# Altium project Capstone_Mainboard_B.PrjPcb (part 1 of 3)
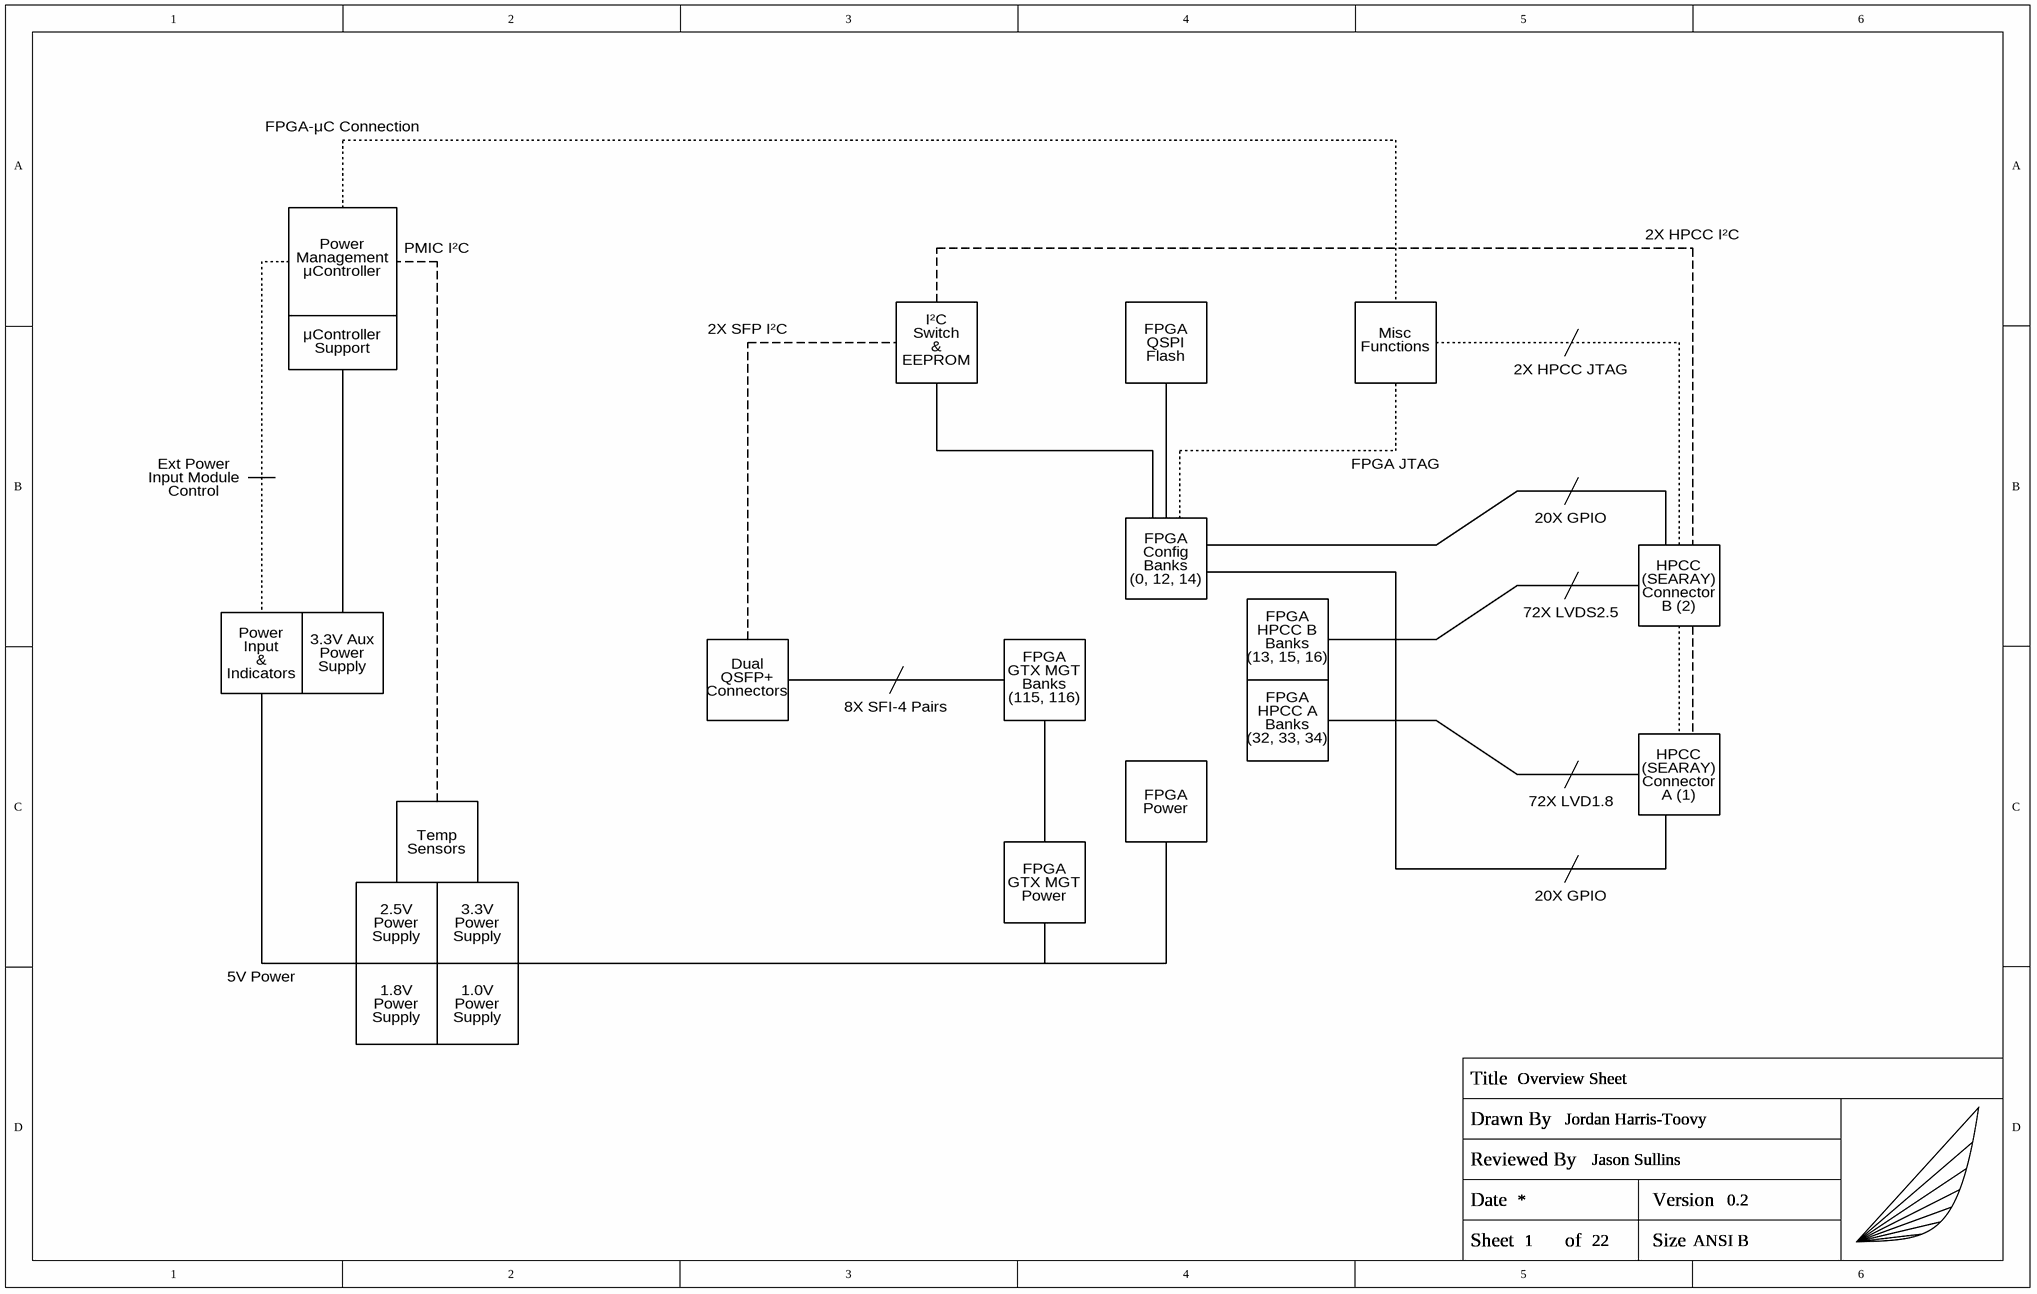
[diagram p0: Overview_Sheet.SchDoc]
22 sheets, 369 parts. Net scope: global (net labels, ports and power ports of the same name join across sheets).
Board file: Main_Board.PcbDoc
Sheets:
  Overview_Sheet.SchDoc
    FPGA QSPI FLASH = Flash_FPGA.SchDoc
    I2C Switch & EEPROM = I2C_Switch_EEPROM.SchDoc
    QSFP+ Connectors = QSFP_Connectors.SchDoc
    HPCC Connector A = HPCC_Connector_A.SchDoc
    HPCC Connector B = HPCC_Connector_B.SchDoc
    3.3V Power Supply = PMIC_3V3.SchDoc
    2.5V Power Supply = PMIC_2V5.SchDoc
    1.8V Power Supply = PMIC_1V8.SchDoc
    1.0V Power Supply = PMIC_1V0.SchDoc
    PMIC-Area Temperature Sensors = I2C_Temperature_Sensors.SchDoc
    Management Microcontroller = Management_RP2040.SchDoc
    FPGA Power Banks = FPGA_Power.SchDoc
    FPGA Configuration Banks = FGPA_Configuration.SchDoc
    FPGA HPCC A Banks = FPGA_HPCC_A_DPs.SchDoc
    FPGA HPCC B Banks = FPGA_HPCC_B_DPs.SchDoc
    FPGA GTX Banks = FPGA_GTXs.SchDoc
    Power Inputs and LEDs = Power_Input_Indicators.SchDoc
    Miscellaneous Functions = Miscellaneous_Functions.SchDoc
    GTX Power Supplies = PMIC_GTXs.SchDoc
    Management Microcontroller Support = Management_RP2040_Support.SchDoc
    3.3V Auxiliary Power Supply = PMIC_3V3AUX_PWR-DEF.SchDoc

## Sheet Overview_Sheet.SchDoc: Overview Sheet
size B; CheckedBy: Jason Sullins; Author: Jordan Harris-Toovy; Revision: 0.2; SheetNumber: 1; SheetTotal: 22; Size: ANSI B

### Parts
(Parts that share a designator on the sheet are numbered #1, #2 ... from top to bottom, then left to right.)
TITLEBLOCK?#1  Capstone_Title_Block  (value not drawn)  (graphical)

### Sub-sheets
1.0V Power Supply = PMIC_1V0.SchDoc: no entries
1.8V Power Supply = PMIC_1V8.SchDoc: no entries
2.5V Power Supply = PMIC_2V5.SchDoc: no entries
3.3V Auxiliary Power Supply = PMIC_3V3AUX_PWR-DEF.SchDoc: no entries
3.3V Power Supply = PMIC_3V3.SchDoc: no entries
FPGA Configuration Banks = FGPA_Configuration.SchDoc: no entries
FPGA GTX Banks = FPGA_GTXs.SchDoc: no entries
FPGA HPCC A Banks = FPGA_HPCC_A_DPs.SchDoc: no entries
FPGA HPCC B Banks = FPGA_HPCC_B_DPs.SchDoc: no entries
FPGA Power Banks = FPGA_Power.SchDoc: no entries
FPGA QSPI FLASH = Flash_FPGA.SchDoc: no entries
GTX Power Supplies = PMIC_GTXs.SchDoc: no entries
HPCC Connector A = HPCC_Connector_A.SchDoc: no entries
HPCC Connector B = HPCC_Connector_B.SchDoc: no entries
I2C Switch & EEPROM = I2C_Switch_EEPROM.SchDoc: no entries
Management Microcontroller = Management_RP2040.SchDoc: no entries
Management Microcontroller Support = Management_RP2040_Support.SchDoc: no entries
Miscellaneous Functions = Miscellaneous_Functions.SchDoc: no entries
PMIC-Area Temperature Sensors = I2C_Temperature_Sensors.SchDoc: no entries
Power Inputs and LEDs = Power_Input_Indicators.SchDoc: no entries
QSFP+ Connectors = QSFP_Connectors.SchDoc: no entries

### Notes on the sheet
- FPGA-μC Connection
- 2X HPCC I²C
- Power
- Management
- μController
- PMIC I²C
- Support
- 2X SFP I²C
- I²C
- Switch
- &
- EEPROM
- FPGA
- QSPI
- Flash
- Misc
- Functions
- 2X HPCC JTAG
- Ext Power
- Input Module
- Control
- FPGA JTAG
- Config
- Banks
- 20X GPIO
- HPCC
- Input
- 3.3V Aux
- (0, 12, 14)
- HPCC B
- 72X LVDS2.5
- (SEARAY)
- Connector
- B (2)
- Indicators
- Supply
- Dual
- QSFP+
- Connectors
- 8X SFI-4 Pairs
- GTX MGT
- (115, 116)
- (13, 15, 16)
- HPCC A
- (32, 33, 34)
- Temp
- 72X LVD1.8
- A (1)
- 2.5V
- Sensors
- 3.3V
- 5V Power
- 1.8V
- 1.0V
- (in symbol Capstone_Title_Block) Title; Drawn By; Reviewed By; Date; Version; Sheet; of; Size

### Library data of the parts
TITLEBLOCK?#1 = Capstone_Title_Block: Custom title block with personal logo; Manufacturer: NONE; Manufacturer Part Number: NONE

## Sheet Flash_FPGA.SchDoc: FPGA QSPI FLASH
size B; CheckedBy: Jason Sullins; Author: Jordan Harris-Toovy; Revision: 0.2; SheetNumber: 21; SheetTotal: 22; Size: ANSI B
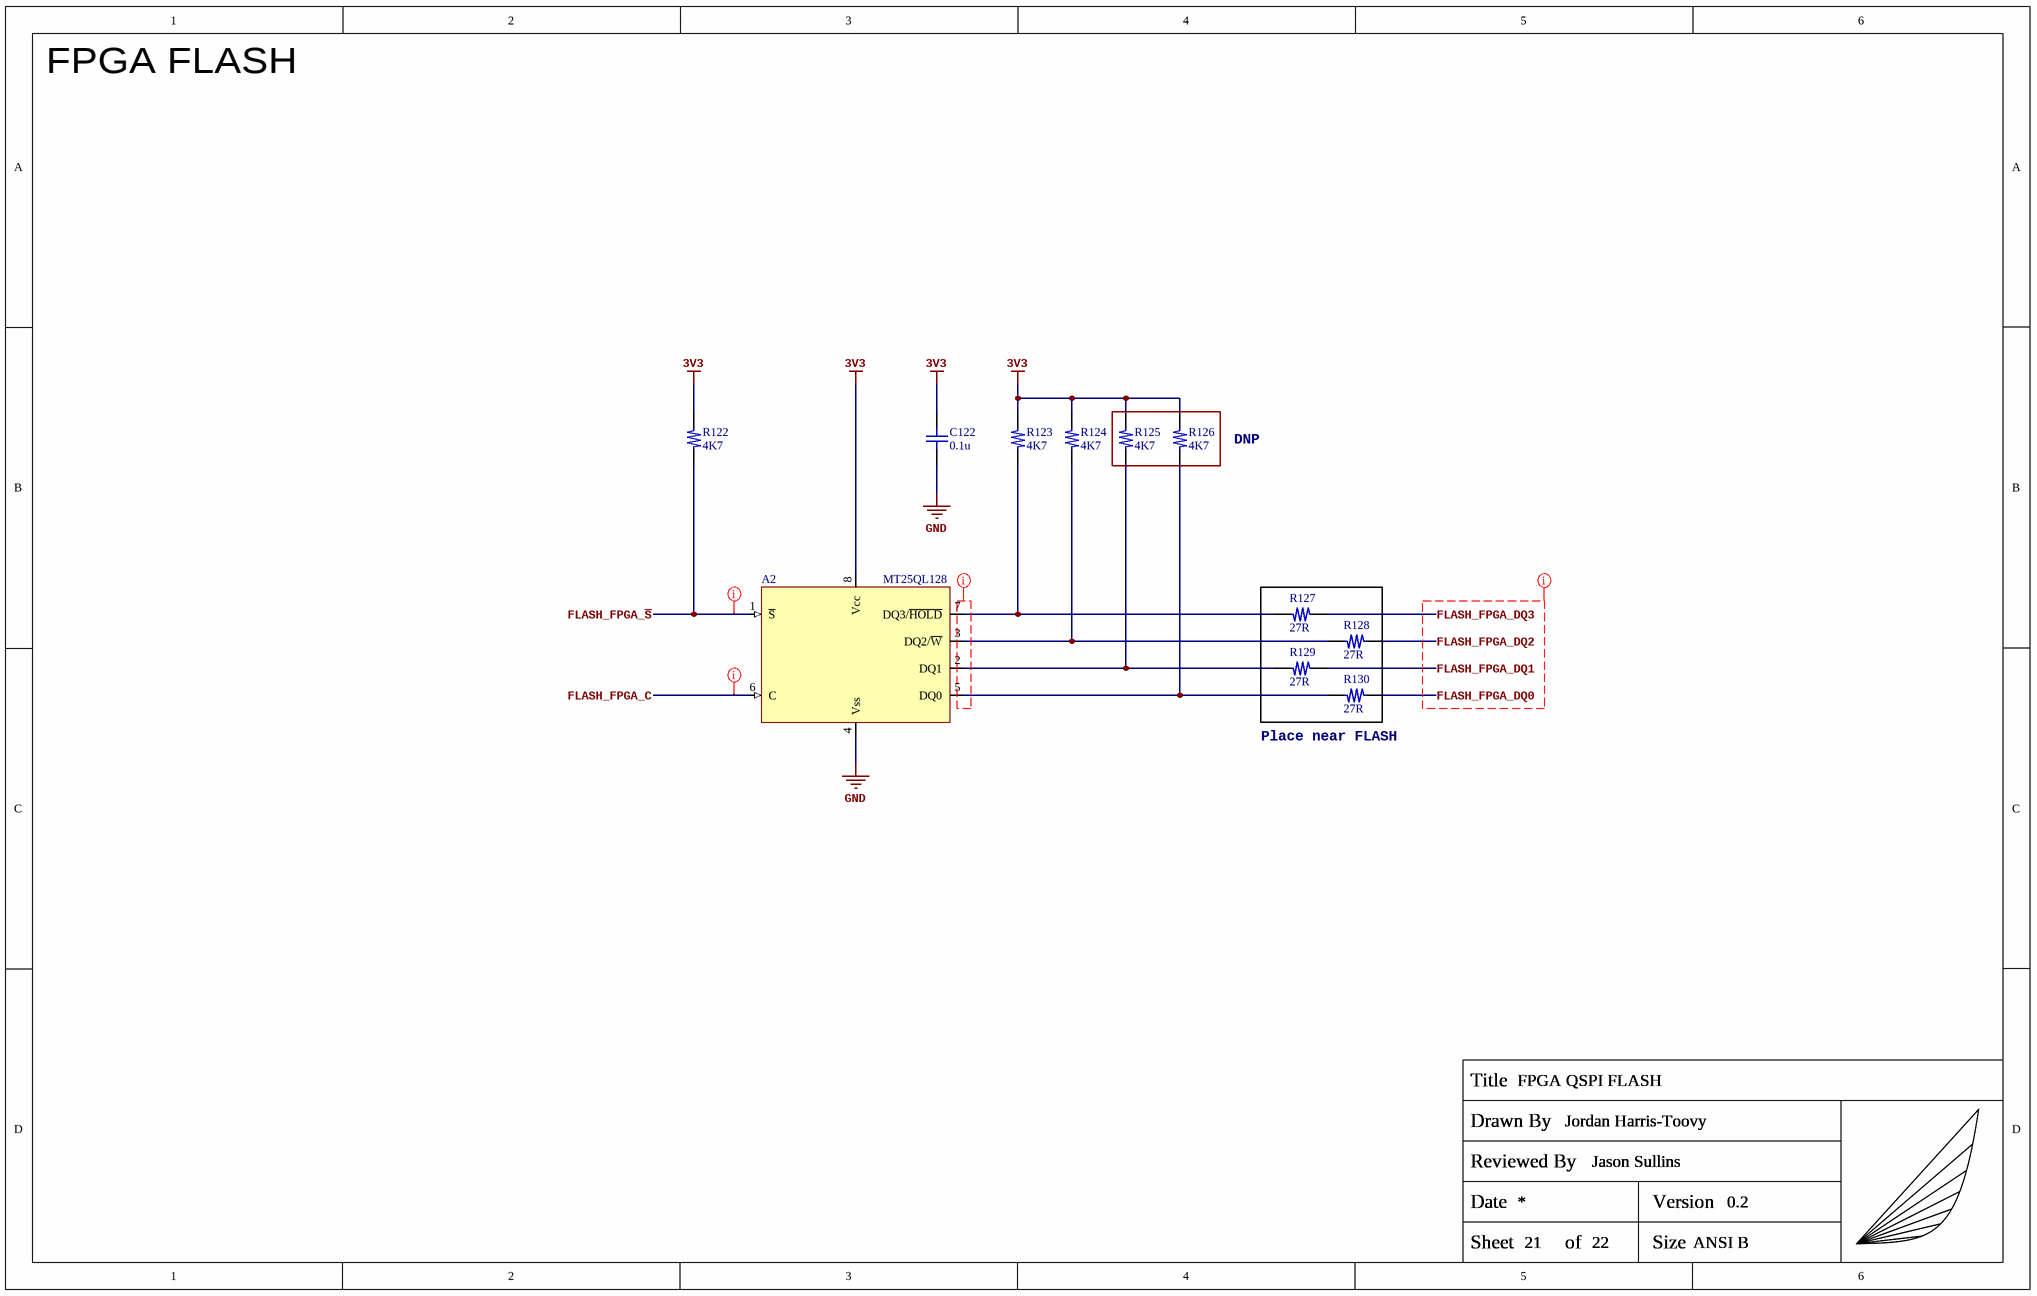
[diagram p1: Flash_FPGA.SchDoc]

### Parts
(Parts that share a designator on the sheet are numbered #1, #2 ... from top to bottom, then left to right.)
A2  MT25QL128  [LOTES_ACA-SPI-004-K01]
C122  0.1u  [C_0402_Generic]
R122  4K7  [R_0402_Generic]
R123  4K7  [R_0402_Generic]
R124  4K7  [R_0402_Generic]
R125  4K7  [R_0402_Generic]
R126  4K7  [R_0402_Generic]
R127  27R  [R_0402_Generic]
R128  27R  [R_0402_Generic]
R129  27R  [R_0402_Generic]
R130  27R  [R_0402_Generic]
TITLEBLOCK?#2  Capstone_Title_Block  (value not drawn)  (graphical)

### Nets
3V3: A2.8(Vcc) C122.2 R122.2 R123.2 R124.2 R125.2 R126.2
GND: A2.4(Vss) C122.1
FLASH_FPGA_C: A2.6(C)
FLASH_FPGA_DQ0: R130.1
FLASH_FPGA_DQ1: R129.1
FLASH_FPGA_DQ2: R128.1
FLASH_FPGA_DQ3: R127.1
FLASH_FPGA_~{S}: A2.1(~{S}) R122.1
NetA2_2: A2.2(DQ1) R125.1 R129.2
NetA2_3: A2.3(DQ2/~{W}) R124.1 R128.2
NetA2_5: A2.5(DQ0) R126.1 R130.2
NetA2_7: A2.7(DQ3/~{HOLD}) R123.1 R127.2

### Layout directives
net class SE50_FGPA_FLASH: FLASH_FPGA_C, FLASH_FPGA_DQ0, FLASH_FPGA_DQ1, FLASH_FPGA_DQ2, FLASH_FPGA_DQ3, FLASH_FPGA_~{S}
net class SE50_GENERAL: (no net found under the mark)

### Notes on the sheet
- FPGA FLASH
- DNP
- (near R130) Place near FLASH
- (in symbol Capstone_Title_Block) Title; Drawn By; Reviewed By; Date; Version; Sheet; of; Size

### Library data of the parts
A2 = MT25QL128ABA1ESE_ACA-SPI-004: FLASH - NOR Memory IC 128Mbit SPI (Q)SPI 133 MHz 8-SO In ACA-SPI-004-K01 socket; Manufacturer: Micron Technology Inc; Manufacturer Part Number: MT25QL128ABA1ESE; Manufacturer2: LOTES; Manufacturer2 Part Number: ACA-SPI-004-K01
C122 = GRM155R71C104KA88D: 0.1µF 16V X7R SMD ceramic capacitor in 0402 size; Manufacturer: Murata Electronics; Manufacturer Part Number: GRM155R71C104KA88D
R122-R126 = ERJ-2RKF4701X: 4.7KOhm 1% 1/10W SMD resistor in 0402 size; Manufacturer: Panasonic; Manufacturer Part Number: ERJ-2RKF4701X
R127-R130 = ERJ-2RKF27R0X: 27Ohm 1% 1/10W SMD resistor in 0402 size; Manufacturer: Panasonic; Manufacturer Part Number: ERJ-2RKF27R0X
TITLEBLOCK?#2 = Capstone_Title_Block: as TITLEBLOCK?#1 on sheet Overview_Sheet; Manufacturer Part Number: NONE

## Sheet I2C_Switch_EEPROM.SchDoc: I²C Switch & EEPROM
size B; CheckedBy: Jason Sullins; Author: Jordan Harris-Toovy; Revision: 0.2; SheetNumber: 5; SheetTotal: 22; Size: ANSI B
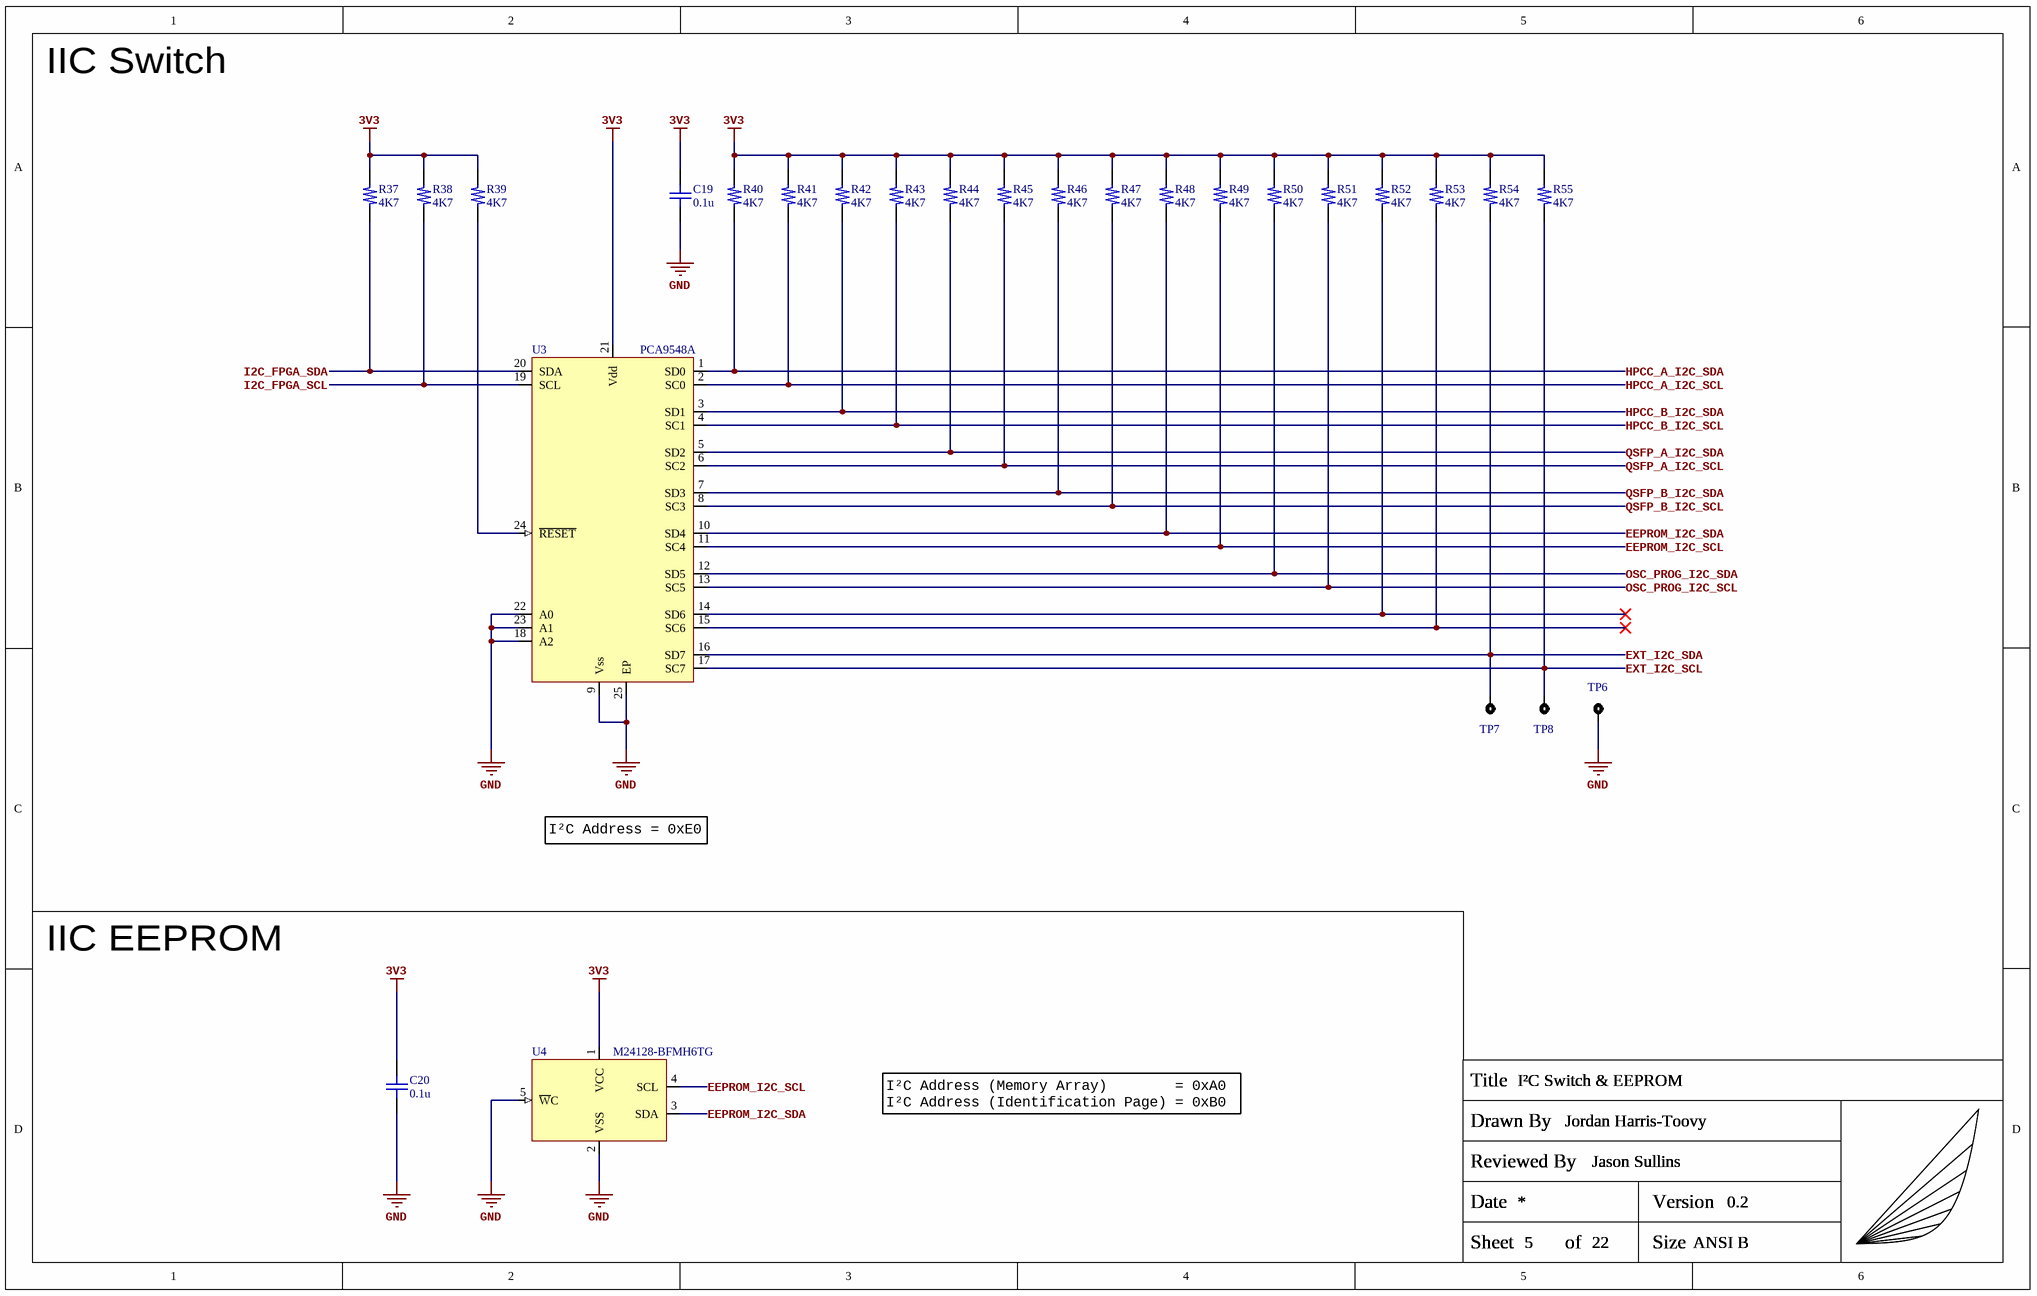
[diagram p2: I2C_Switch_EEPROM.SchDoc]

### Parts
(Parts that share a designator on the sheet are numbered #1, #2 ... from top to bottom, then left to right.)
C19  0.1u  [C_0402_Generic]
C20  0.1u  [C_0402_Generic]
R37  4K7  [R_0402_Generic]
R38  4K7  [R_0402_Generic]
R39  4K7  [R_0402_Generic]
R40  4K7  [R_0402_Generic]
R41  4K7  [R_0402_Generic]
R42  4K7  [R_0402_Generic]
R43  4K7  [R_0402_Generic]
R44  4K7  [R_0402_Generic]
R45  4K7  [R_0402_Generic]
R46  4K7  [R_0402_Generic]
R47  4K7  [R_0402_Generic]
R48  4K7  [R_0402_Generic]
R49  4K7  [R_0402_Generic]
R50  4K7  [R_0402_Generic]
R51  4K7  [R_0402_Generic]
R52  4K7  [R_0402_Generic]
R53  4K7  [R_0402_Generic]
R54  4K7  [R_0402_Generic]
R55  4K7  [R_0402_Generic]
TITLEBLOCK?#3  Capstone_Title_Block  (value not drawn)  (graphical)
TP6  EXT I2C GND Test Point  [TP_3MM]  (value not drawn)
TP7  EXT I2C SDA Test Point  [TP_3MM]  (value not drawn)
TP8  EXT I2C SCL Test Point  [TP_3MM]  (value not drawn)
U3  PCA9548A  [HVQFN24_NXP]
U4  M24128-BFMH6TG  [STM_DFN5]

### Nets
3V3: C19.2 C20.2 R37.2 R38.2 R39.2 R40.2 R41.2 R42.2 R43.2 R44.2 R45.2 R46.2 R47.2 R48.2 R49.2 R50.2 R51.2 R52.2 R53.2 R54.2 R55.2 U3.21(Vdd) U4.1(VCC)
GND: C19.1 C20.1 TP6.1 U3.9(Vss) U3.18(A2) U3.22(A0) U3.23(A1) U3.25(EP) U4.2(VSS) U4.5(~{W}C)
EEPROM_I2C_SCL: R49.1 U3.11(SC4) U4.4(SCL)
EEPROM_I2C_SDA: R48.1 U3.10(SD4) U4.3(SDA)
EXT_I2C_SCL: R55.1 TP8.1 U3.17(SC7)
EXT_I2C_SDA: R54.1 TP7.1 U3.16(SD7)
HPCC_A_I2C_SCL: R41.1 U3.2(SC0)
HPCC_A_I2C_SDA: R40.1 U3.1(SD0)
HPCC_B_I2C_SCL: R43.1 U3.4(SC1)
HPCC_B_I2C_SDA: R42.1 U3.3(SD1)
I2C_FPGA_SCL: R38.1 U3.19(SCL)
I2C_FPGA_SDA: R37.1 U3.20(SDA)
OSC_PROG_I2C_SCL: R51.1 U3.13(SC5)
OSC_PROG_I2C_SDA: R50.1 U3.12(SD5)
QSFP_A_I2C_SCL: R45.1 U3.6(SC2)
QSFP_A_I2C_SDA: R44.1 U3.5(SD2)
QSFP_B_I2C_SCL: R47.1 U3.8(SC3)
QSFP_B_I2C_SDA: R46.1 U3.7(SD3)
NetR39_1: R39.1 U3.24(~{RESET})
NetR52_1: R52.1 U3.14(SD6)
NetR53_1: R53.1 U3.15(SC6)

### Notes on the sheet
- IIC Switch
- I²C Address = 0xE0
- IIC EEPROM
- I²C Address (Memory Array)        = 0xA0
  I²C Address (Identification Page) = 0xB0
- (in symbol Capstone_Title_Block) Title; Drawn By; Reviewed By; Date; Version; Sheet; of; Size

### Library data of the parts
C19 C20 = GRM155R71C104KA88D: as C122 on sheet Flash_FPGA; Manufacturer Part Number: GRM155R71C104KA88D
R37-R55 = ERJ-2RKF4701X: as R122 on sheet Flash_FPGA; Manufacturer Part Number: ERJ-2RKF4701X
TITLEBLOCK?#3 = Capstone_Title_Block: as TITLEBLOCK?#1 on sheet Overview_Sheet; Manufacturer Part Number: NONE
TP6-TP8 = SMD Test Point: SMD Test point 3mm circle; Manufacturer: NONE; Manufacturer Part Number: NONE
U3 = PCA9548ABS,118: 8-channel I 2 C-bus switch, 24-HVQFN; Manufacturer: NXP; Manufacturer Part Number: PCA9548ABS,118
U4 = M24128-BFMH6TG: EEPROM 128Kbit I2C 1MHz 450 ns; Manufacturer: STMicroelectronics; Manufacturer Part Number: M24128-BFMH6TG

## Sheet QSFP_Connectors.SchDoc: QSFP+ Connectors & Filtering
size B; CheckedBy: Jason Sullins; Author: Jordan Harris-Toovy; Revision: 0.2; SheetNumber: 7; SheetTotal: 22; Size: ANSI B
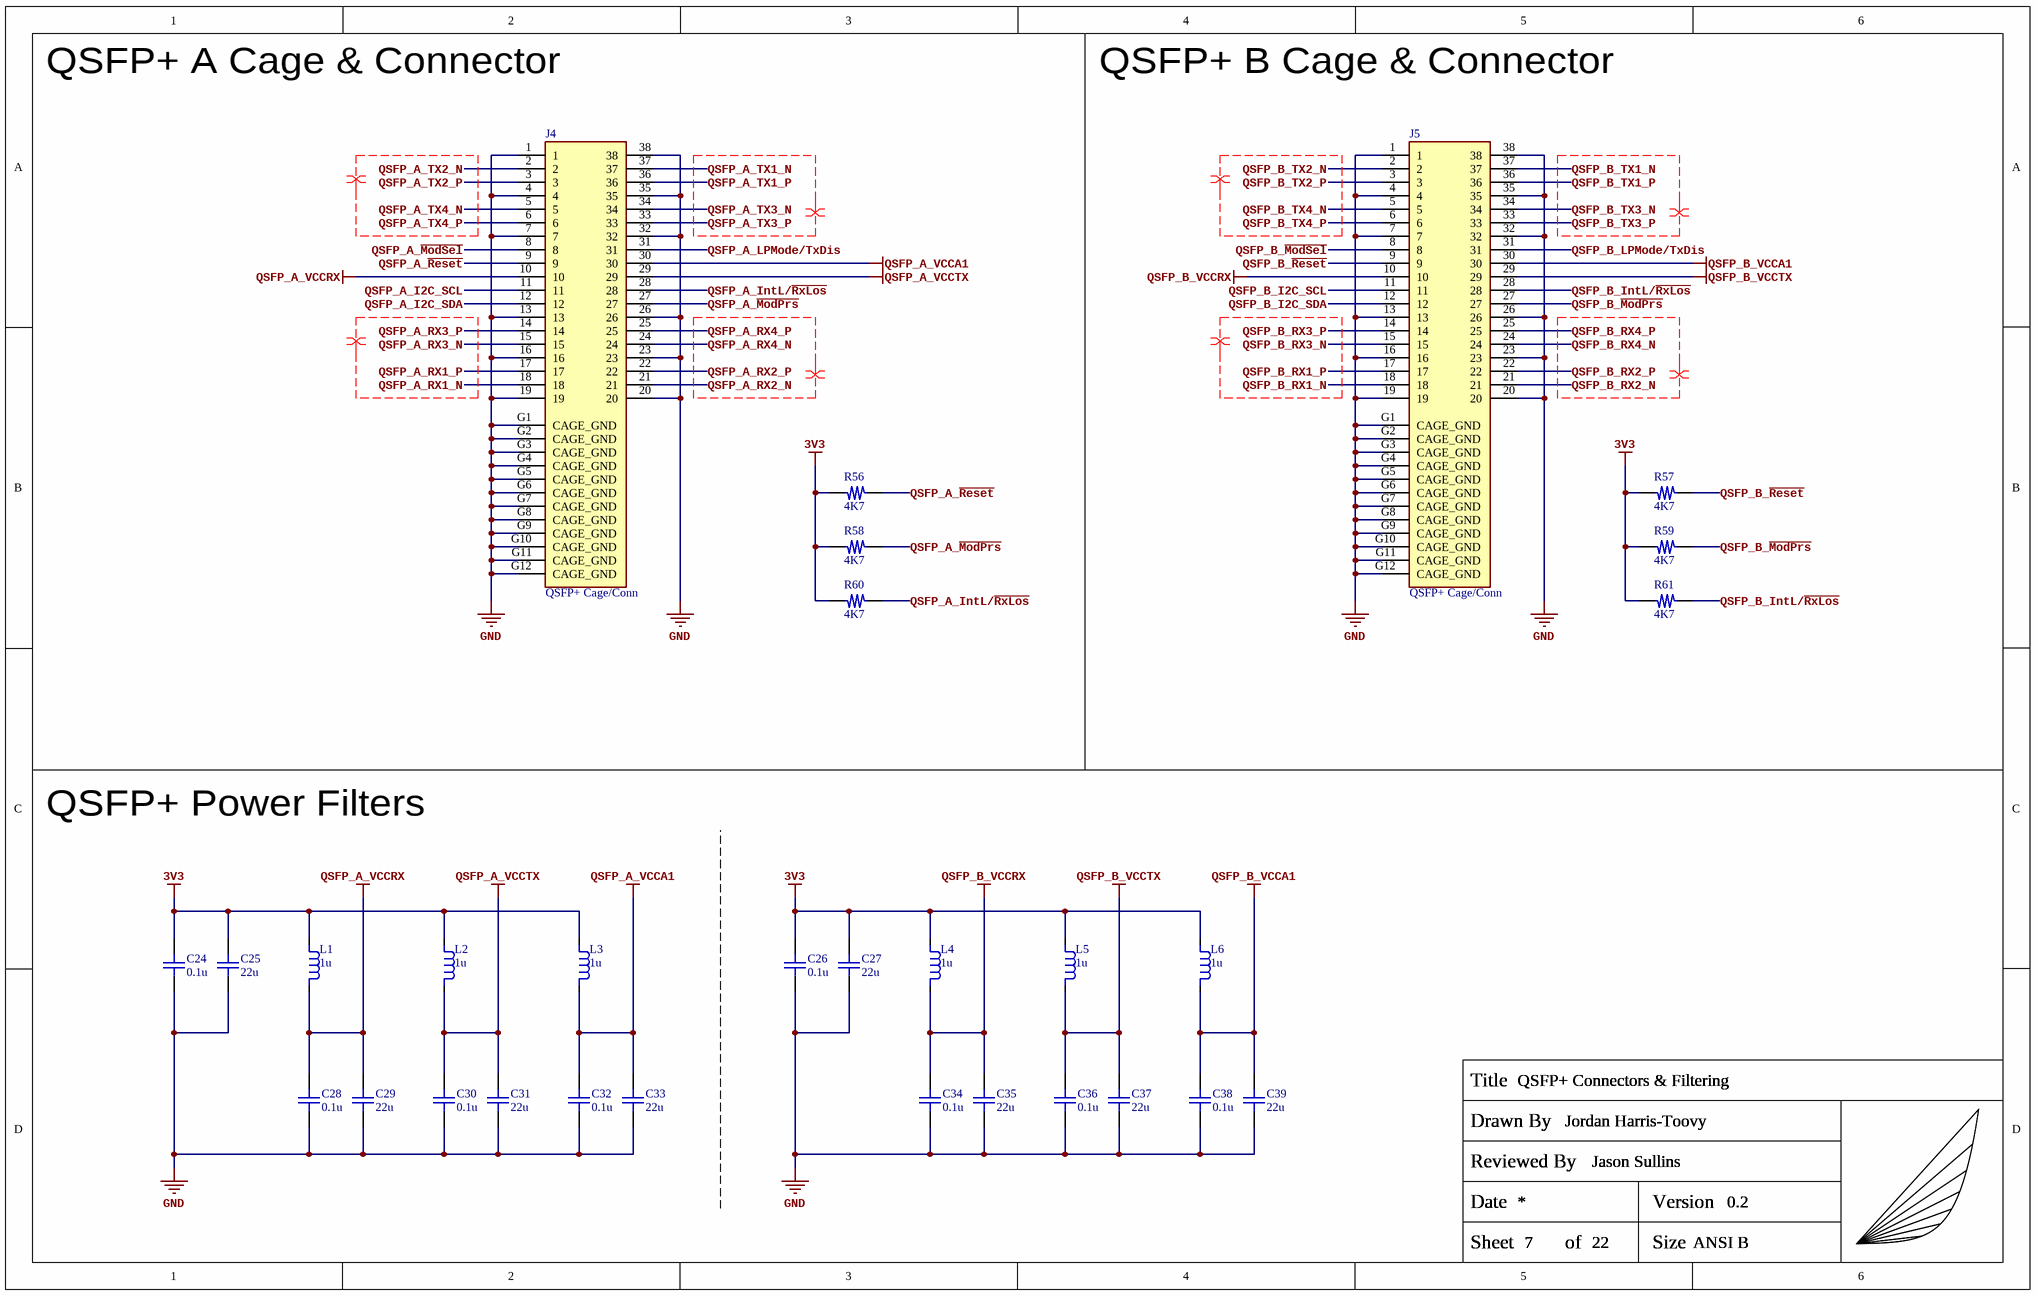
[diagram p3: QSFP_Connectors.SchDoc]

### Parts
(Parts that share a designator on the sheet are numbered #1, #2 ... from top to bottom, then left to right.)
C24  0.1u  [C_0402_Generic]
C25  22u  [C_0603_Generic]
C26  0.1u  [C_0402_Generic]
C27  22u  [C_0603_Generic]
C28  0.1u  [C_0402_Generic]
C29  22u  [C_0603_Generic]
C30  0.1u  [C_0402_Generic]
C31  22u  [C_0603_Generic]
C32  0.1u  [C_0402_Generic]
C33  22u  [C_0603_Generic]
C34  0.1u  [C_0402_Generic]
C35  22u  [C_0603_Generic]
C36  0.1u  [C_0402_Generic]
C37  22u  [C_0603_Generic]
C38  0.1u  [C_0402_Generic]
C39  22u  [C_0603_Generic]
J4  QSFP+ Cage/Conn  [AMPHENOL_U95T151100A]
J5  QSFP+ Cage/Conn  [AMPHENOL_U95T151100A]
L1  1u  [Murata_Ind_1008]
L2  1u  [Murata_Ind_1008]
L3  1u  [Murata_Ind_1008]
L4  1u  [Murata_Ind_1008]
L5  1u  [Murata_Ind_1008]
L6  1u  [Murata_Ind_1008]
R56  4K7  [R_0402_Generic]
R57  4K7  [R_0402_Generic]
R58  4K7  [R_0402_Generic]
R59  4K7  [R_0402_Generic]
R60  4K7  [R_0402_Generic]
R61  4K7  [R_0402_Generic]
TITLEBLOCK?#4  Capstone_Title_Block  (value not drawn)  (graphical)

### Nets
3V3: C24.2 C25.2 C26.2 C27.2 L1.2 L2.2 L3.2 L4.2 L5.2 L6.2 R56.2 R57.2 R58.2 R59.2 R60.2 R61.2
GND: C24.1 C25.1 C26.1 C27.1 C28.1 C29.1 C30.1 C31.1 C32.1 C33.1 C34.1 C35.1 C36.1 C37.1 C38.1 C39.1 J4.1 J4.4 J4.7 J4.13 J4.16 J4.19 J4.20 J4.23 J4.26 J4.32 J4.35 J4.38 J4.G1(CAGE_GND) J4.G2(CAGE_GND) J4.G3(CAGE_GND) J4.G4(CAGE_GND) J4.G5(CAGE_GND) J4.G6(CAGE_GND) J4.G7(CAGE_GND) J4.G8(CAGE_GND) J4.G9(CAGE_GND) J4.G10(CAGE_GND) J4.G11(CAGE_GND) J4.G12(CAGE_GND) J5.1 J5.4 J5.7 J5.13 J5.16 J5.19 J5.20 J5.23 J5.26 J5.32 J5.35 J5.38 J5.G1(CAGE_GND) J5.G2(CAGE_GND) J5.G3(CAGE_GND) J5.G4(CAGE_GND) J5.G5(CAGE_GND) J5.G6(CAGE_GND) J5.G7(CAGE_GND) J5.G8(CAGE_GND) J5.G9(CAGE_GND) J5.G10(CAGE_GND) J5.G11(CAGE_GND) J5.G12(CAGE_GND)
QSFP_A_VCCA1: C32.2 C33.2 J4.30 L3.1
QSFP_A_VCCRX: C28.2 C29.2 J4.10 L1.1
QSFP_A_VCCTX: C30.2 C31.2 J4.29 L2.1
QSFP_B_VCCA1: C38.2 C39.2 J5.30 L6.1
QSFP_B_VCCRX: C34.2 C35.2 J5.10 L4.1
QSFP_B_VCCTX: C36.2 C37.2 J5.29 L5.1
QSFP_A_I2C_SCL: J4.11
QSFP_A_I2C_SDA: J4.12
QSFP_A_IntL/~{RxLos}: J4.28 R60.1
QSFP_A_LPMode/TxDis: J4.31
QSFP_A_~{ModPrs}: J4.27 R58.1
QSFP_A_~{ModSel}: J4.8
QSFP_A_~{Reset}: J4.9 R56.1
QSFP_A_RX1_N: J4.18
QSFP_A_RX1_P: J4.17
QSFP_A_RX2_N: J4.21
QSFP_A_RX2_P: J4.22
QSFP_A_RX3_N: J4.15
QSFP_A_RX3_P: J4.14
QSFP_A_RX4_N: J4.24
QSFP_A_RX4_P: J4.25
QSFP_A_TX1_N: J4.37
QSFP_A_TX1_P: J4.36
QSFP_A_TX2_N: J4.2
QSFP_A_TX2_P: J4.3
QSFP_A_TX3_N: J4.34
QSFP_A_TX3_P: J4.33
QSFP_A_TX4_N: J4.5
QSFP_A_TX4_P: J4.6
QSFP_B_I2C_SCL: J5.11
QSFP_B_I2C_SDA: J5.12
QSFP_B_IntL/~{RxLos}: J5.28 R61.1
QSFP_B_LPMode/TxDis: J5.31
QSFP_B_~{ModPrs}: J5.27 R59.1
QSFP_B_~{ModSel}: J5.8
QSFP_B_~{Reset}: J5.9 R57.1
QSFP_B_RX1_N: J5.18
QSFP_B_RX1_P: J5.17
QSFP_B_RX2_N: J5.21
QSFP_B_RX2_P: J5.22
QSFP_B_RX3_N: J5.15
QSFP_B_RX3_P: J5.14
QSFP_B_RX4_N: J5.24
QSFP_B_RX4_P: J5.25
QSFP_B_TX1_N: J5.37
QSFP_B_TX1_P: J5.36
QSFP_B_TX2_N: J5.2
QSFP_B_TX2_P: J5.3
QSFP_B_TX3_N: J5.34
QSFP_B_TX3_P: J5.33
QSFP_B_TX4_N: J5.5
QSFP_B_TX4_P: J5.6

### Layout directives
differential pair; differential pair class DP100_QSFP: QSFP_A_RX1_N, QSFP_A_RX1_P, QSFP_A_RX2_N, QSFP_A_RX2_P, QSFP_A_RX3_N, QSFP_A_RX3_P, QSFP_A_RX4_N, QSFP_A_RX4_P, QSFP_A_TX1_N, QSFP_A_TX1_P, QSFP_A_TX2_N, QSFP_A_TX2_P, QSFP_A_TX3_N, QSFP_A_TX3_P, QSFP_A_TX4_N, QSFP_A_TX4_P, QSFP_B_RX1_N, QSFP_B_RX1_P, QSFP_B_RX2_N, QSFP_B_RX2_P, QSFP_B_RX3_N, QSFP_B_RX3_P, QSFP_B_RX4_N, QSFP_B_RX4_P, QSFP_B_TX1_N, QSFP_B_TX1_P, QSFP_B_TX2_N, QSFP_B_TX2_P, QSFP_B_TX3_N, QSFP_B_TX3_P, QSFP_B_TX4_N, QSFP_B_TX4_P

### Notes on the sheet
- QSFP+ A Cage & Connector
- QSFP+ B Cage & Connector
- QSFP+ Power Filters
- (in symbol Capstone_Title_Block) Title; Drawn By; Reviewed By; Date; Version; Sheet; of; Size

### Library data of the parts
C24 C26 C28 C30 C32 C34 C36 C38 = GRM155R71C104KA88D: as C122 on sheet Flash_FPGA; Manufacturer Part Number: GRM155R71C104KA88D
C25 C27 C29 C31 C33 C35 C37 C39 = GRM188R60J226MEA0D: 22µF 6.3V X5R SMD ceramic capacitor in 0603 size; Manufacturer: Murata Electronics; Manufacturer Part Number: GRM188R60J226MEA0D
J4 J5 = U95T151100A_FS1-Z38-20Z6-6: Amphenol 38 Position QSFP+ receptacle and cage; Manufacturer: Amphenol ICC; Manufacturer Part Number: U95-T151-100A; Manufacturer2 Part Number: FS1-Z38-20Z6-60; Manufacturer2: Amphenol ICC
L1-L6 = DFE252012F-1R0M=P2: 1µH Shielded 3.3A 40mOhm 1008 Inductor; Manufacturer: Murata Electronics; Manufacturer Part Number: DFE252012F-1R0M=P2
R56-R61 = ERJ-2RKF4701X: as R122 on sheet Flash_FPGA; Manufacturer Part Number: ERJ-2RKF4701X
TITLEBLOCK?#4 = Capstone_Title_Block: as TITLEBLOCK?#1 on sheet Overview_Sheet; Manufacturer Part Number: NONE

## Sheet HPCC_Connector_A.SchDoc: HPCC Connector A
size B; CheckedBy: Jason Sullins; Author: Jordan Harris-Toovy; Revision: 0.2; SheetNumber: 8; SheetTotal: 22; Size: ANSI B
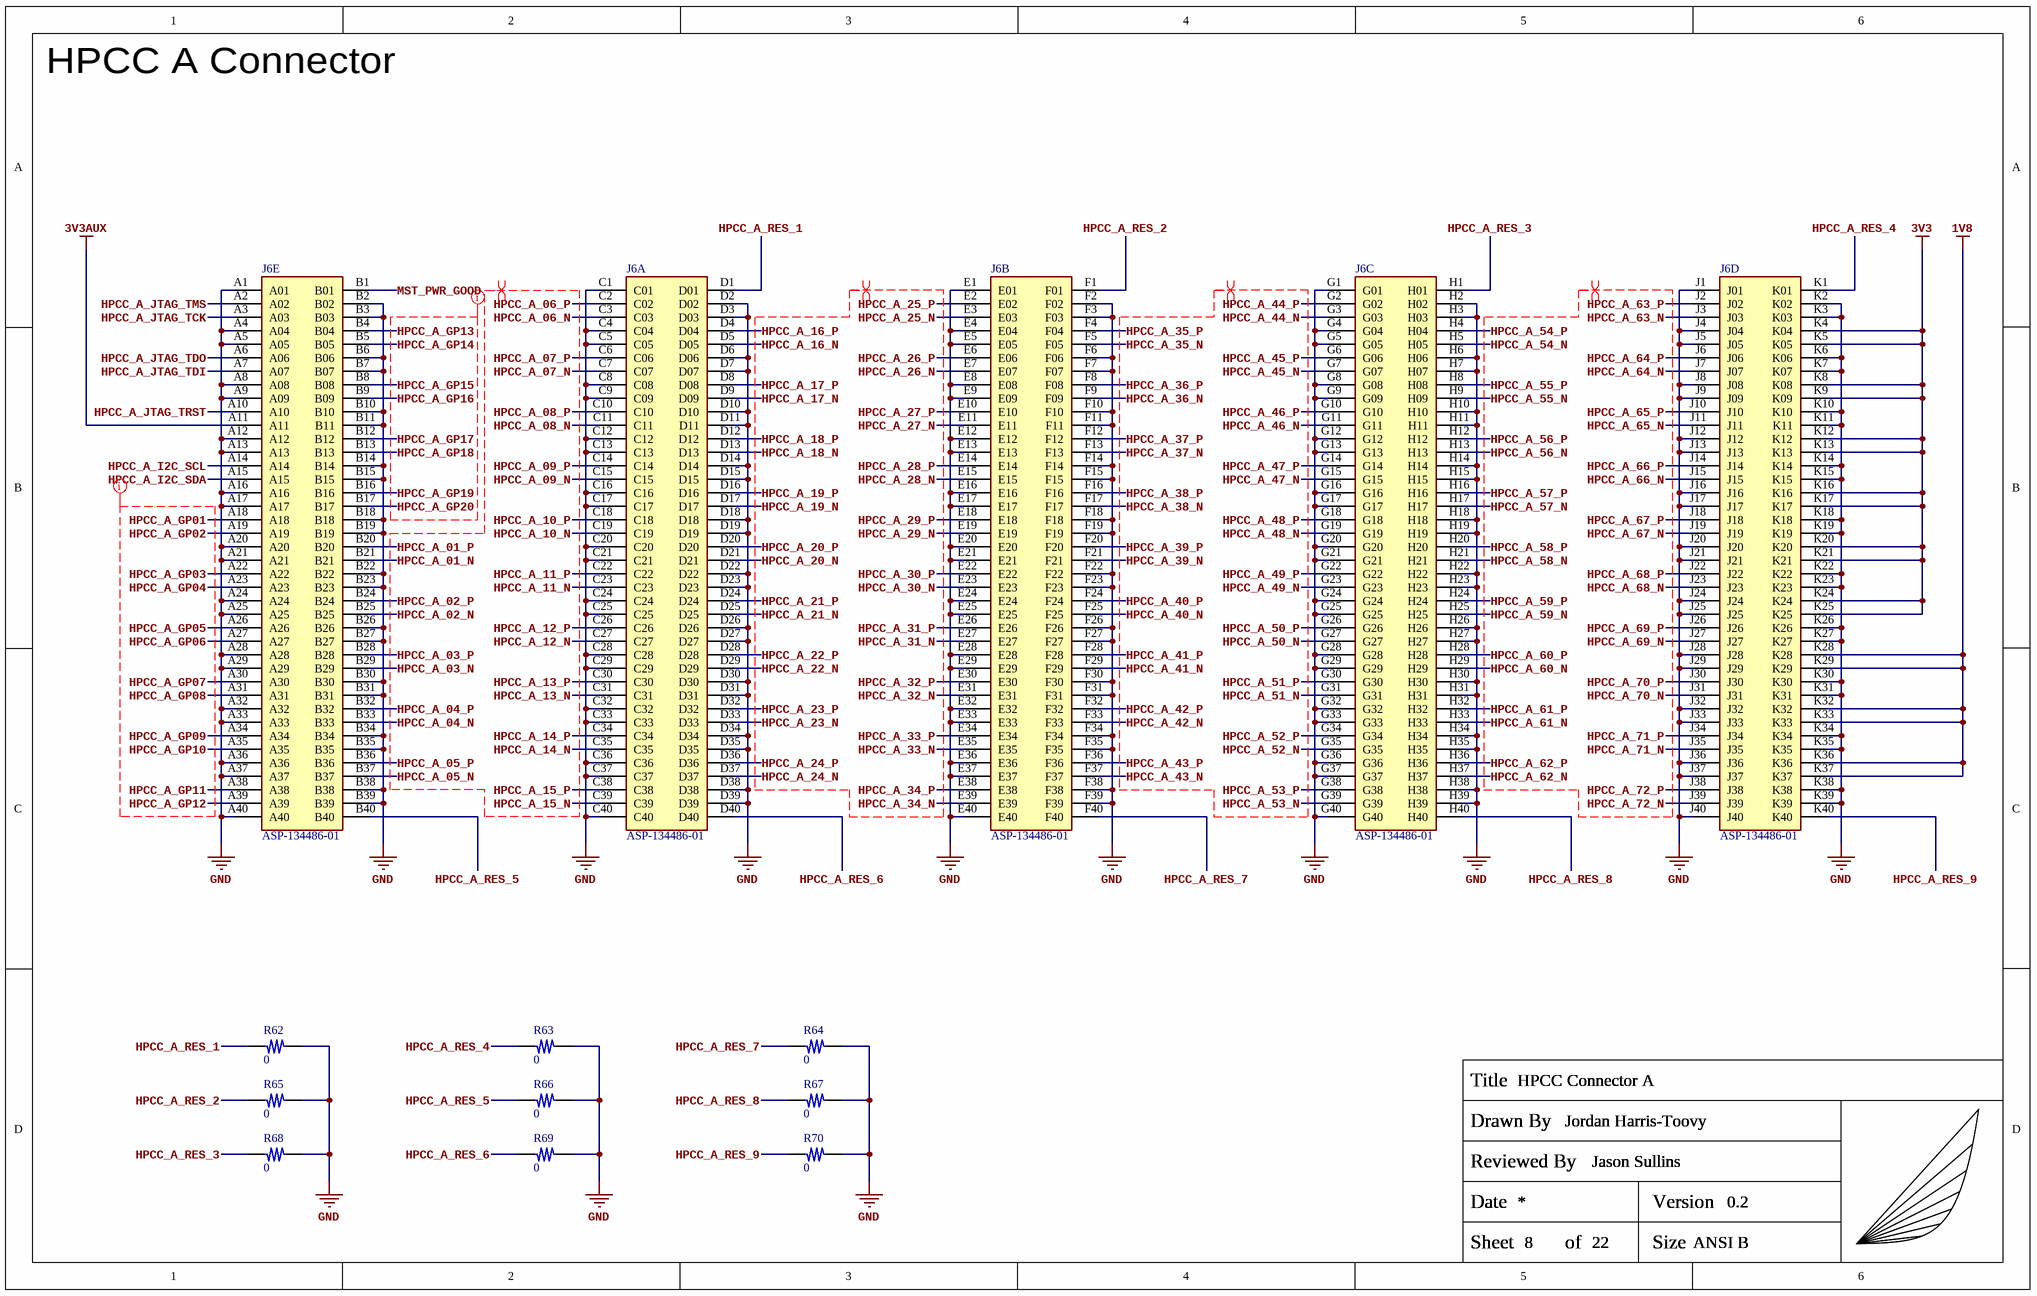
[diagram p4: HPCC_Connector_A.SchDoc]

### Parts
(Parts that share a designator on the sheet are numbered #1, #2 ... from top to bottom, then left to right.)
J6  ASP-134486-01  [SAMTEC_ASP-134486-01]  (parts A,B,C,D,E of 5)
R62  0  [R_0402_Generic]
R63  0  [R_0402_Generic]
R64  0  [R_0402_Generic]
R65  0  [R_0402_Generic]
R66  0  [R_0402_Generic]
R67  0  [R_0402_Generic]
R68  0  [R_0402_Generic]
R69  0  [R_0402_Generic]
R70  0  [R_0402_Generic]
TITLEBLOCK?#5  Capstone_Title_Block  (value not drawn)  (graphical)

### Nets
1V8: J6.K28 J6.K29 J6.K32 J6.K33 J6.K36 J6.K37
3V3: J6.K4(K04) J6.K5(K05) J6.K8(K08) J6.K9(K09) J6.K12 J6.K13 J6.K16 J6.K17 J6.K20 J6.K21 J6.K24 J6.K25
3V3AUX: J6.A11
GND: J6.A1(A01) J6.A4(A04) J6.A5(A05) J6.A8(A08) J6.A9(A09) J6.A12 J6.A13 J6.A16 J6.A17 J6.A20 J6.A21 J6.A24 J6.A25 J6.A28 J6.A29 J6.A32 J6.A33 J6.A36 J6.A37 J6.A40 J6.B2(B02) J6.B3(B03) J6.B6(B06) J6.B7(B07) J6.B10 J6.B11 J6.B14 J6.B15 J6.B18 J6.B19 J6.B22 J6.B23 J6.B26 J6.B27 J6.B30 J6.B31 J6.B34 J6.B35 J6.B38 J6.B39 J6.C1(C01) J6.C4(C04) J6.C5(C05) J6.C8(C08) J6.C9(C09) J6.C12 J6.C13 J6.C16 J6.C17 J6.C20 J6.C21 J6.C24 J6.C25 J6.C28 J6.C29 J6.C32 J6.C33 J6.C36 J6.C37 J6.C40 J6.D2(D02) J6.D3(D03) J6.D6(D06) J6.D7(D07) J6.D10 J6.D11 J6.D14 J6.D15 J6.D18 J6.D19 J6.D22 J6.D23 J6.D26 J6.D27 J6.D30 J6.D31 J6.D34 J6.D35 J6.D38 J6.D39 J6.E1(E01) J6.E4(E04) J6.E5(E05) J6.E8(E08) J6.E9(E09) J6.E12 J6.E13 J6.E16 J6.E17 J6.E20 J6.E21 J6.E24 J6.E25 J6.E28 J6.E29 J6.E32 J6.E33 J6.E36 J6.E37 J6.E40 J6.F2(F02) J6.F3(F03) J6.F6(F06) J6.F7(F07) J6.F10 J6.F11 J6.F14 J6.F15 J6.F18 J6.F19 J6.F22 J6.F23 J6.F26 J6.F27 J6.F30 J6.F31 J6.F34 J6.F35 J6.F38 J6.F39 J6.G1(G01) J6.G4(G04) J6.G5(G05) J6.G8(G08) J6.G9(G09) J6.G12 J6.G13 J6.G16 J6.G17 J6.G20 J6.G21 J6.G24 J6.G25 J6.G28 J6.G29 J6.G32 J6.G33 J6.G36 J6.G37 J6.G40 J6.H2(H02) J6.H3(H03) J6.H6(H06) J6.H7(H07) J6.H10 J6.H11 J6.H14 J6.H15 J6.H18 J6.H19 J6.H22 J6.H23 J6.H26 J6.H27 J6.H30 J6.H31 J6.H34 J6.H35 J6.H38 J6.H39 J6.J1(J01) J6.J4(J04) J6.J5(J05) J6.J8(J08) J6.J9(J09) J6.J12 J6.J13 J6.J16 J6.J17 J6.J20 J6.J21 J6.J24 J6.J25 J6.J28 J6.J29 J6.J32 J6.J33 J6.J36 J6.J37 J6.J40 J6.K2(K02) J6.K3(K03) J6.K6(K06) J6.K7(K07) J6.K10 J6.K11 J6.K14 J6.K15 J6.K18 J6.K19 J6.K22 J6.K23 J6.K26 J6.K27 J6.K30 J6.K31 J6.K34 J6.K35 J6.K38 J6.K39 R62.1 R63.1 R64.1 R65.1 R66.1 R67.1 R68.1 R69.1 R70.1
HPCC_A_01_N: J6.B21
HPCC_A_01_P: J6.B20
HPCC_A_02_N: J6.B25
HPCC_A_02_P: J6.B24
HPCC_A_03_N: J6.B29
HPCC_A_03_P: J6.B28
HPCC_A_04_N: J6.B33
HPCC_A_04_P: J6.B32
HPCC_A_05_N: J6.B37
HPCC_A_05_P: J6.B36
HPCC_A_06_N: J6.C3(C03)
HPCC_A_06_P: J6.C2(C02)
HPCC_A_07_N: J6.C7(C07)
HPCC_A_07_P: J6.C6(C06)
HPCC_A_08_N: J6.C11
HPCC_A_08_P: J6.C10
HPCC_A_09_N: J6.C15
HPCC_A_09_P: J6.C14
HPCC_A_10_N: J6.C19
HPCC_A_10_P: J6.C18
HPCC_A_11_N: J6.C23
HPCC_A_11_P: J6.C22
HPCC_A_12_N: J6.C27
HPCC_A_12_P: J6.C26
HPCC_A_13_N: J6.C31
HPCC_A_13_P: J6.C30
HPCC_A_14_N: J6.C35
HPCC_A_14_P: J6.C34
HPCC_A_15_N: J6.C39
HPCC_A_15_P: J6.C38
HPCC_A_16_N: J6.D5(D05)
HPCC_A_16_P: J6.D4(D04)
HPCC_A_17_N: J6.D9(D09)
HPCC_A_17_P: J6.D8(D08)
HPCC_A_18_N: J6.D13
HPCC_A_18_P: J6.D12
HPCC_A_19_N: J6.D17
HPCC_A_19_P: J6.D16
HPCC_A_20_N: J6.D21
HPCC_A_20_P: J6.D20
HPCC_A_21_N: J6.D25
HPCC_A_21_P: J6.D24
HPCC_A_22_N: J6.D29
HPCC_A_22_P: J6.D28
HPCC_A_23_N: J6.D33
HPCC_A_23_P: J6.D32
HPCC_A_24_N: J6.D37
HPCC_A_24_P: J6.D36
HPCC_A_25_N: J6.E3(E03)
HPCC_A_25_P: J6.E2(E02)
HPCC_A_26_N: J6.E7(E07)
HPCC_A_26_P: J6.E6(E06)
HPCC_A_27_N: J6.E11
HPCC_A_27_P: J6.E10
HPCC_A_28_N: J6.E15
HPCC_A_28_P: J6.E14
HPCC_A_29_N: J6.E19
HPCC_A_29_P: J6.E18
HPCC_A_30_N: J6.E23
HPCC_A_30_P: J6.E22
HPCC_A_31_N: J6.E27
HPCC_A_31_P: J6.E26
HPCC_A_32_N: J6.E31
HPCC_A_32_P: J6.E30
HPCC_A_33_N: J6.E35
HPCC_A_33_P: J6.E34
HPCC_A_34_N: J6.E39
HPCC_A_34_P: J6.E38
HPCC_A_35_N: J6.F5(F05)
HPCC_A_35_P: J6.F4(F04)
HPCC_A_36_N: J6.F9(F09)
HPCC_A_36_P: J6.F8(F08)
HPCC_A_37_N: J6.F13
HPCC_A_37_P: J6.F12
HPCC_A_38_N: J6.F17
HPCC_A_38_P: J6.F16
HPCC_A_39_N: J6.F21
HPCC_A_39_P: J6.F20
HPCC_A_40_N: J6.F25
HPCC_A_40_P: J6.F24
HPCC_A_41_N: J6.F29
HPCC_A_41_P: J6.F28
HPCC_A_42_N: J6.F33
HPCC_A_42_P: J6.F32
HPCC_A_43_N: J6.F37
HPCC_A_43_P: J6.F36
HPCC_A_44_N: J6.G3(G03)
HPCC_A_44_P: J6.G2(G02)
HPCC_A_45_N: J6.G7(G07)
HPCC_A_45_P: J6.G6(G06)
HPCC_A_46_N: J6.G11
HPCC_A_46_P: J6.G10
HPCC_A_47_N: J6.G15
HPCC_A_47_P: J6.G14
HPCC_A_48_N: J6.G19
HPCC_A_48_P: J6.G18
HPCC_A_49_N: J6.G23
HPCC_A_49_P: J6.G22
HPCC_A_50_N: J6.G27
HPCC_A_50_P: J6.G26
HPCC_A_51_N: J6.G31
HPCC_A_51_P: J6.G30
HPCC_A_52_N: J6.G35
HPCC_A_52_P: J6.G34
HPCC_A_53_N: J6.G39
HPCC_A_53_P: J6.G38
HPCC_A_54_N: J6.H5(H05)
HPCC_A_54_P: J6.H4(H04)
HPCC_A_55_N: J6.H9(H09)
HPCC_A_55_P: J6.H8(H08)
HPCC_A_56_N: J6.H13
HPCC_A_56_P: J6.H12
HPCC_A_57_N: J6.H17
HPCC_A_57_P: J6.H16
HPCC_A_58_N: J6.H21
HPCC_A_58_P: J6.H20
HPCC_A_59_N: J6.H25
HPCC_A_59_P: J6.H24
HPCC_A_60_N: J6.H29
HPCC_A_60_P: J6.H28
HPCC_A_61_N: J6.H33
HPCC_A_61_P: J6.H32
HPCC_A_62_N: J6.H37
HPCC_A_62_P: J6.H36
HPCC_A_63_N: J6.J3(J03)
HPCC_A_63_P: J6.J2(J02)
HPCC_A_64_N: J6.J7(J07)
HPCC_A_64_P: J6.J6(J06)
HPCC_A_65_N: J6.J11
HPCC_A_65_P: J6.J10
HPCC_A_66_N: J6.J15
HPCC_A_66_P: J6.J14
HPCC_A_67_N: J6.J19
HPCC_A_67_P: J6.J18
HPCC_A_68_N: J6.J23
HPCC_A_68_P: J6.J22
HPCC_A_69_N: J6.J27
HPCC_A_69_P: J6.J26
HPCC_A_70_N: J6.J31
HPCC_A_70_P: J6.J30
HPCC_A_71_N: J6.J35
HPCC_A_71_P: J6.J34
HPCC_A_72_N: J6.J39
HPCC_A_72_P: J6.J38
HPCC_A_GP01: J6.A18
HPCC_A_GP02: J6.A19
HPCC_A_GP03: J6.A22
HPCC_A_GP04: J6.A23
HPCC_A_GP05: J6.A26
HPCC_A_GP06: J6.A27
HPCC_A_GP07: J6.A30
HPCC_A_GP08: J6.A31
HPCC_A_GP09: J6.A34
HPCC_A_GP10: J6.A35
HPCC_A_GP11: J6.A38
HPCC_A_GP12: J6.A39
HPCC_A_GP13: J6.B4(B04)
HPCC_A_GP14: J6.B5(B05)
HPCC_A_GP15: J6.B8(B08)
HPCC_A_GP16: J6.B9(B09)
HPCC_A_GP17: J6.B12
HPCC_A_GP18: J6.B13
HPCC_A_GP19: J6.B16
HPCC_A_GP20: J6.B17
HPCC_A_I2C_SCL: J6.A14
HPCC_A_I2C_SDA: J6.A15
HPCC_A_JTAG_TCK: J6.A3(A03)
HPCC_A_JTAG_TDI: J6.A7(A07)
HPCC_A_JTAG_TDO: J6.A6(A06)
HPCC_A_JTAG_TMS: J6.A2(A02)
HPCC_A_JTAG_TRST: J6.A10
HPCC_A_RES_1: J6.D1(D01) R62.2
HPCC_A_RES_2: J6.F1(F01) R65.2
HPCC_A_RES_3: J6.H1(H01) R68.2
HPCC_A_RES_4: J6.K1(K01) R63.2
HPCC_A_RES_5: J6.B40 R66.2
HPCC_A_RES_6: J6.D40 R69.2
HPCC_A_RES_7: J6.F40 R64.2
HPCC_A_RES_8: J6.H40 R67.2
HPCC_A_RES_9: J6.K40 R70.2
MST_PWR_GOOD: J6.B1(B01)

### Layout directives
differential pair; differential pair class DP100_HPCC_A: HPCC_A_01_N, HPCC_A_01_P, HPCC_A_02_N, HPCC_A_02_P, HPCC_A_03_N, HPCC_A_03_P, HPCC_A_04_N, HPCC_A_04_P, HPCC_A_05_N, HPCC_A_05_P, HPCC_A_06_N, HPCC_A_06_P, HPCC_A_07_N, HPCC_A_07_P, HPCC_A_08_N, HPCC_A_08_P, HPCC_A_09_N, HPCC_A_09_P, HPCC_A_10_N, HPCC_A_10_P, HPCC_A_11_N, HPCC_A_11_P, HPCC_A_12_N, HPCC_A_12_P, HPCC_A_13_N, HPCC_A_13_P, HPCC_A_14_N, HPCC_A_14_P, HPCC_A_15_N, HPCC_A_15_P, HPCC_A_16_N, HPCC_A_16_P, HPCC_A_17_N, HPCC_A_17_P, HPCC_A_18_N, HPCC_A_18_P, HPCC_A_19_N, HPCC_A_19_P, HPCC_A_20_N, HPCC_A_20_P, HPCC_A_21_N, HPCC_A_21_P, HPCC_A_22_N, HPCC_A_22_P, HPCC_A_23_N, HPCC_A_23_P, HPCC_A_24_N, HPCC_A_24_P, HPCC_A_25_N, HPCC_A_25_P, HPCC_A_26_N, HPCC_A_26_P, HPCC_A_27_N, HPCC_A_27_P, HPCC_A_28_N, HPCC_A_28_P, HPCC_A_29_N, HPCC_A_29_P, HPCC_A_30_N, HPCC_A_30_P, HPCC_A_31_N, HPCC_A_31_P, HPCC_A_32_N, HPCC_A_32_P, HPCC_A_33_N, HPCC_A_33_P, HPCC_A_34_N, HPCC_A_34_P, HPCC_A_35_N, HPCC_A_35_P, HPCC_A_36_N, HPCC_A_36_P, HPCC_A_37_N, HPCC_A_37_P, HPCC_A_38_N, HPCC_A_38_P, HPCC_A_39_N, HPCC_A_39_P, HPCC_A_40_N, HPCC_A_40_P, HPCC_A_41_N, HPCC_A_41_P, HPCC_A_42_N, HPCC_A_42_P, HPCC_A_43_N, HPCC_A_43_P, HPCC_A_44_N, HPCC_A_44_P, HPCC_A_45_N, HPCC_A_45_P, HPCC_A_46_N, HPCC_A_46_P, HPCC_A_47_N, HPCC_A_47_P, HPCC_A_48_N, HPCC_A_48_P, HPCC_A_49_N, HPCC_A_49_P, HPCC_A_50_N, HPCC_A_50_P, HPCC_A_51_N, HPCC_A_51_P, HPCC_A_52_N, HPCC_A_52_P, HPCC_A_53_N, HPCC_A_53_P, HPCC_A_54_N, HPCC_A_54_P, HPCC_A_55_N, HPCC_A_55_P, HPCC_A_56_N, HPCC_A_56_P, HPCC_A_57_N, HPCC_A_57_P, HPCC_A_58_N, HPCC_A_58_P, HPCC_A_59_N, HPCC_A_59_P, HPCC_A_60_N, HPCC_A_60_P, HPCC_A_61_N, HPCC_A_61_P, HPCC_A_62_N, HPCC_A_62_P, HPCC_A_63_N, HPCC_A_63_P, HPCC_A_64_N, HPCC_A_64_P, HPCC_A_65_N, HPCC_A_65_P, HPCC_A_66_N, HPCC_A_66_P, HPCC_A_67_N, HPCC_A_67_P, HPCC_A_68_N, HPCC_A_68_P, HPCC_A_69_N, HPCC_A_69_P, HPCC_A_70_N, HPCC_A_70_P, HPCC_A_71_N, HPCC_A_71_P, HPCC_A_72_N, HPCC_A_72_P
net class SE50_HPCC_A: HPCC_A_GP01, HPCC_A_GP02, HPCC_A_GP03, HPCC_A_GP04, HPCC_A_GP05, HPCC_A_GP06, HPCC_A_GP07, HPCC_A_GP08, HPCC_A_GP09, HPCC_A_GP10, HPCC_A_GP11, HPCC_A_GP12, HPCC_A_GP13, HPCC_A_GP14, HPCC_A_GP15, HPCC_A_GP16, HPCC_A_GP17, HPCC_A_GP18, HPCC_A_GP19, HPCC_A_GP20

### Notes on the sheet
- HPCC A Connector
- (in symbol Capstone_Title_Block) Title; Drawn By; Reviewed By; Date; Version; Sheet; of; Size

### Library data of the parts
J6 = ASP-134486-01: 400 Position Connector Array, Female Sockets Surface Mount Gold; Manufacturer: Samtec; Manufacturer Part Number: ASP-134486-01
R62-R70 = ERJ-2GE0R00X: Jumper 0Ohm SMD resistor in 0402 size; Manufacturer: Panasonic; Manufacturer Part Number: ERJ-2GE0R00X
TITLEBLOCK?#5 = Capstone_Title_Block: as TITLEBLOCK?#1 on sheet Overview_Sheet; Manufacturer Part Number: NONE

## Sheet HPCC_Connector_B.SchDoc: HPCC Connector B
size B; CheckedBy: Jason Sullins; Author: Jordan Harris-Toovy; Revision: 0.2; SheetNumber: 9; SheetTotal: 22; Size: ANSI B
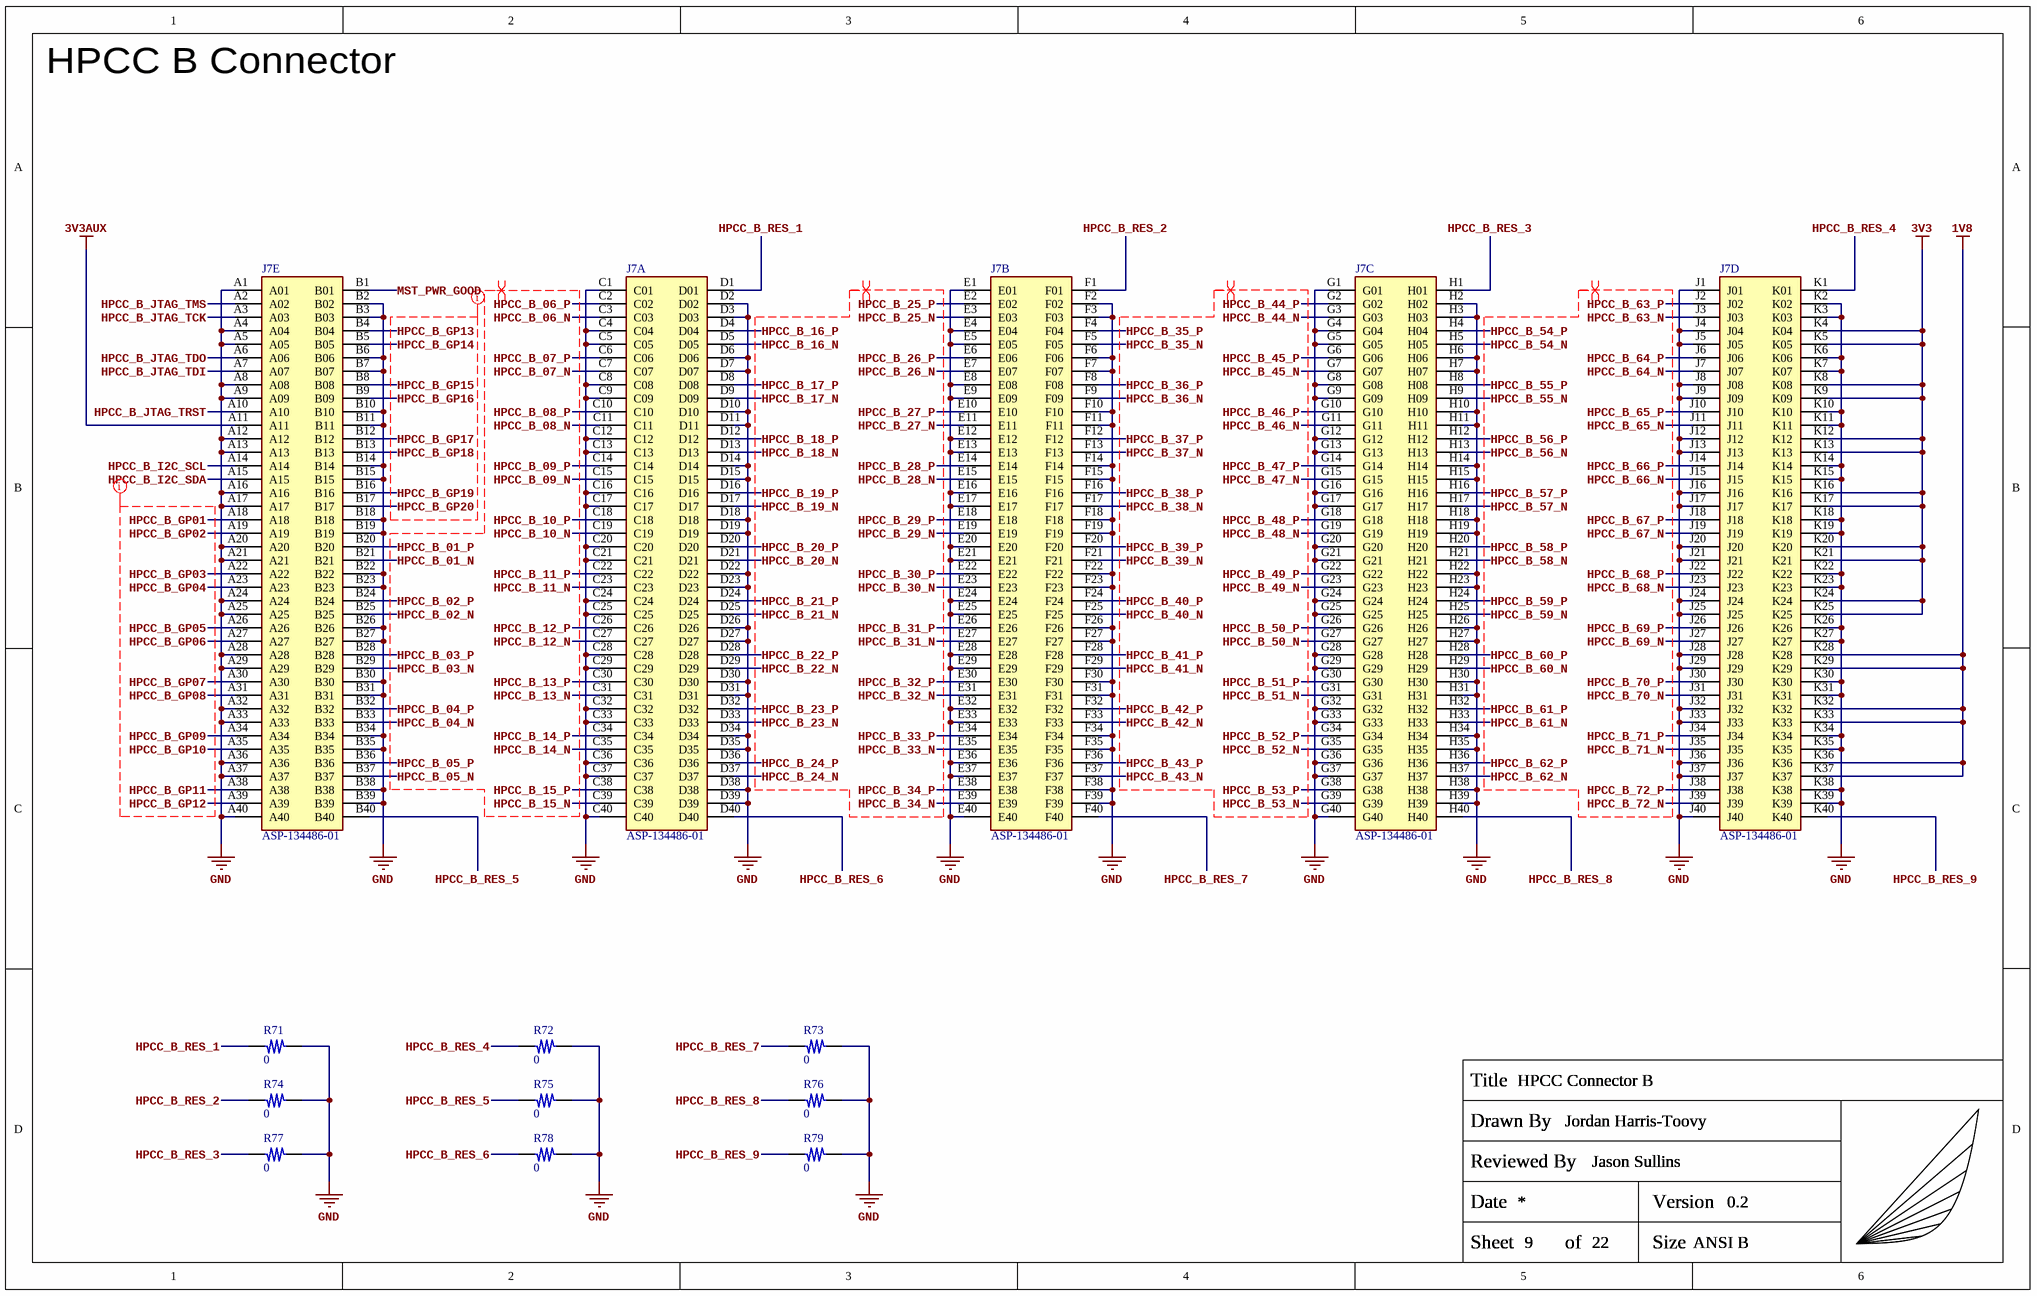
[diagram p5: HPCC_Connector_B.SchDoc]

### Parts
(Parts that share a designator on the sheet are numbered #1, #2 ... from top to bottom, then left to right.)
J7  ASP-134486-01  [SAMTEC_ASP-134486-01]  (parts A,B,C,D,E of 5)
R71  0  [R_0402_Generic]
R72  0  [R_0402_Generic]
R73  0  [R_0402_Generic]
R74  0  [R_0402_Generic]
R75  0  [R_0402_Generic]
R76  0  [R_0402_Generic]
R77  0  [R_0402_Generic]
R78  0  [R_0402_Generic]
R79  0  [R_0402_Generic]
TITLEBLOCK?#6  Capstone_Title_Block  (value not drawn)  (graphical)

### Nets
1V8: J7.K28 J7.K29 J7.K32 J7.K33 J7.K36 J7.K37
3V3: J7.K4(K04) J7.K5(K05) J7.K8(K08) J7.K9(K09) J7.K12 J7.K13 J7.K16 J7.K17 J7.K20 J7.K21 J7.K24 J7.K25
3V3AUX: J7.A11
GND: J7.A1(A01) J7.A4(A04) J7.A5(A05) J7.A8(A08) J7.A9(A09) J7.A12 J7.A13 J7.A16 J7.A17 J7.A20 J7.A21 J7.A24 J7.A25 J7.A28 J7.A29 J7.A32 J7.A33 J7.A36 J7.A37 J7.A40 J7.B2(B02) J7.B3(B03) J7.B6(B06) J7.B7(B07) J7.B10 J7.B11 J7.B14 J7.B15 J7.B18 J7.B19 J7.B22 J7.B23 J7.B26 J7.B27 J7.B30 J7.B31 J7.B34 J7.B35 J7.B38 J7.B39 J7.C1(C01) J7.C4(C04) J7.C5(C05) J7.C8(C08) J7.C9(C09) J7.C12 J7.C13 J7.C16 J7.C17 J7.C20 J7.C21 J7.C24 J7.C25 J7.C28 J7.C29 J7.C32 J7.C33 J7.C36 J7.C37 J7.C40 J7.D2(D02) J7.D3(D03) J7.D6(D06) J7.D7(D07) J7.D10 J7.D11 J7.D14 J7.D15 J7.D18 J7.D19 J7.D22 J7.D23 J7.D26 J7.D27 J7.D30 J7.D31 J7.D34 J7.D35 J7.D38 J7.D39 J7.E1(E01) J7.E4(E04) J7.E5(E05) J7.E8(E08) J7.E9(E09) J7.E12 J7.E13 J7.E16 J7.E17 J7.E20 J7.E21 J7.E24 J7.E25 J7.E28 J7.E29 J7.E32 J7.E33 J7.E36 J7.E37 J7.E40 J7.F2(F02) J7.F3(F03) J7.F6(F06) J7.F7(F07) J7.F10 J7.F11 J7.F14 J7.F15 J7.F18 J7.F19 J7.F22 J7.F23 J7.F26 J7.F27 J7.F30 J7.F31 J7.F34 J7.F35 J7.F38 J7.F39 J7.G1(G01) J7.G4(G04) J7.G5(G05) J7.G8(G08) J7.G9(G09) J7.G12 J7.G13 J7.G16 J7.G17 J7.G20 J7.G21 J7.G24 J7.G25 J7.G28 J7.G29 J7.G32 J7.G33 J7.G36 J7.G37 J7.G40 J7.H2(H02) J7.H3(H03) J7.H6(H06) J7.H7(H07) J7.H10 J7.H11 J7.H14 J7.H15 J7.H18 J7.H19 J7.H22 J7.H23 J7.H26 J7.H27 J7.H30 J7.H31 J7.H34 J7.H35 J7.H38 J7.H39 J7.J1(J01) J7.J4(J04) J7.J5(J05) J7.J8(J08) J7.J9(J09) J7.J12 J7.J13 J7.J16 J7.J17 J7.J20 J7.J21 J7.J24 J7.J25 J7.J28 J7.J29 J7.J32 J7.J33 J7.J36 J7.J37 J7.J40 J7.K2(K02) J7.K3(K03) J7.K6(K06) J7.K7(K07) J7.K10 J7.K11 J7.K14 J7.K15 J7.K18 J7.K19 J7.K22 J7.K23 J7.K26 J7.K27 J7.K30 J7.K31 J7.K34 J7.K35 J7.K38 J7.K39 R71.1 R72.1 R73.1 R74.1 R75.1 R76.1 R77.1 R78.1 R79.1
HPCC_B_01_N: J7.B21
HPCC_B_01_P: J7.B20
HPCC_B_02_N: J7.B25
HPCC_B_02_P: J7.B24
HPCC_B_03_N: J7.B29
HPCC_B_03_P: J7.B28
HPCC_B_04_N: J7.B33
HPCC_B_04_P: J7.B32
HPCC_B_05_N: J7.B37
HPCC_B_05_P: J7.B36
HPCC_B_06_N: J7.C3(C03)
HPCC_B_06_P: J7.C2(C02)
HPCC_B_07_N: J7.C7(C07)
HPCC_B_07_P: J7.C6(C06)
HPCC_B_08_N: J7.C11
HPCC_B_08_P: J7.C10
HPCC_B_09_N: J7.C15
HPCC_B_09_P: J7.C14
HPCC_B_10_N: J7.C19
HPCC_B_10_P: J7.C18
HPCC_B_11_N: J7.C23
HPCC_B_11_P: J7.C22
HPCC_B_12_N: J7.C27
HPCC_B_12_P: J7.C26
HPCC_B_13_N: J7.C31
HPCC_B_13_P: J7.C30
HPCC_B_14_N: J7.C35
HPCC_B_14_P: J7.C34
HPCC_B_15_N: J7.C39
HPCC_B_15_P: J7.C38
HPCC_B_16_N: J7.D5(D05)
HPCC_B_16_P: J7.D4(D04)
HPCC_B_17_N: J7.D9(D09)
HPCC_B_17_P: J7.D8(D08)
HPCC_B_18_N: J7.D13
HPCC_B_18_P: J7.D12
HPCC_B_19_N: J7.D17
HPCC_B_19_P: J7.D16
HPCC_B_20_N: J7.D21
HPCC_B_20_P: J7.D20
HPCC_B_21_N: J7.D25
HPCC_B_21_P: J7.D24
HPCC_B_22_N: J7.D29
HPCC_B_22_P: J7.D28
HPCC_B_23_N: J7.D33
HPCC_B_23_P: J7.D32
HPCC_B_24_N: J7.D37
HPCC_B_24_P: J7.D36
HPCC_B_25_N: J7.E3(E03)
HPCC_B_25_P: J7.E2(E02)
HPCC_B_26_N: J7.E7(E07)
HPCC_B_26_P: J7.E6(E06)
HPCC_B_27_N: J7.E11
HPCC_B_27_P: J7.E10
HPCC_B_28_N: J7.E15
HPCC_B_28_P: J7.E14
HPCC_B_29_N: J7.E19
HPCC_B_29_P: J7.E18
HPCC_B_30_N: J7.E23
HPCC_B_30_P: J7.E22
HPCC_B_31_N: J7.E27
HPCC_B_31_P: J7.E26
HPCC_B_32_N: J7.E31
HPCC_B_32_P: J7.E30
HPCC_B_33_N: J7.E35
HPCC_B_33_P: J7.E34
HPCC_B_34_N: J7.E39
HPCC_B_34_P: J7.E38
HPCC_B_35_N: J7.F5(F05)
HPCC_B_35_P: J7.F4(F04)
HPCC_B_36_N: J7.F9(F09)
HPCC_B_36_P: J7.F8(F08)
HPCC_B_37_N: J7.F13
HPCC_B_37_P: J7.F12
HPCC_B_38_N: J7.F17
HPCC_B_38_P: J7.F16
HPCC_B_39_N: J7.F21
HPCC_B_39_P: J7.F20
HPCC_B_40_N: J7.F25
HPCC_B_40_P: J7.F24
HPCC_B_41_N: J7.F29
HPCC_B_41_P: J7.F28
HPCC_B_42_N: J7.F33
HPCC_B_42_P: J7.F32
HPCC_B_43_N: J7.F37
HPCC_B_43_P: J7.F36
HPCC_B_44_N: J7.G3(G03)
HPCC_B_44_P: J7.G2(G02)
HPCC_B_45_N: J7.G7(G07)
HPCC_B_45_P: J7.G6(G06)
HPCC_B_46_N: J7.G11
HPCC_B_46_P: J7.G10
HPCC_B_47_N: J7.G15
HPCC_B_47_P: J7.G14
HPCC_B_48_N: J7.G19
HPCC_B_48_P: J7.G18
HPCC_B_49_N: J7.G23
HPCC_B_49_P: J7.G22
HPCC_B_50_N: J7.G27
HPCC_B_50_P: J7.G26
HPCC_B_51_N: J7.G31
HPCC_B_51_P: J7.G30
HPCC_B_52_N: J7.G35
HPCC_B_52_P: J7.G34
HPCC_B_53_N: J7.G39
HPCC_B_53_P: J7.G38
HPCC_B_54_N: J7.H5(H05)
HPCC_B_54_P: J7.H4(H04)
HPCC_B_55_N: J7.H9(H09)
HPCC_B_55_P: J7.H8(H08)
HPCC_B_56_N: J7.H13
HPCC_B_56_P: J7.H12
HPCC_B_57_N: J7.H17
HPCC_B_57_P: J7.H16
HPCC_B_58_N: J7.H21
HPCC_B_58_P: J7.H20
HPCC_B_59_N: J7.H25
HPCC_B_59_P: J7.H24
HPCC_B_60_N: J7.H29
HPCC_B_60_P: J7.H28
HPCC_B_61_N: J7.H33
HPCC_B_61_P: J7.H32
HPCC_B_62_N: J7.H37
HPCC_B_62_P: J7.H36
HPCC_B_63_N: J7.J3(J03)
HPCC_B_63_P: J7.J2(J02)
HPCC_B_64_N: J7.J7(J07)
HPCC_B_64_P: J7.J6(J06)
HPCC_B_65_N: J7.J11
HPCC_B_65_P: J7.J10
HPCC_B_66_N: J7.J15
HPCC_B_66_P: J7.J14
HPCC_B_67_N: J7.J19
HPCC_B_67_P: J7.J18
HPCC_B_68_N: J7.J23
HPCC_B_68_P: J7.J22
HPCC_B_69_N: J7.J27
HPCC_B_69_P: J7.J26
HPCC_B_70_N: J7.J31
HPCC_B_70_P: J7.J30
HPCC_B_71_N: J7.J35
HPCC_B_71_P: J7.J34
HPCC_B_72_N: J7.J39
HPCC_B_72_P: J7.J38
HPCC_B_GP01: J7.A18
HPCC_B_GP02: J7.A19
HPCC_B_GP03: J7.A22
HPCC_B_GP04: J7.A23
HPCC_B_GP05: J7.A26
HPCC_B_GP06: J7.A27
HPCC_B_GP07: J7.A30
HPCC_B_GP08: J7.A31
HPCC_B_GP09: J7.A34
HPCC_B_GP10: J7.A35
HPCC_B_GP11: J7.A38
HPCC_B_GP12: J7.A39
HPCC_B_GP13: J7.B4(B04)
HPCC_B_GP14: J7.B5(B05)
HPCC_B_GP15: J7.B8(B08)
HPCC_B_GP16: J7.B9(B09)
HPCC_B_GP17: J7.B12
HPCC_B_GP18: J7.B13
HPCC_B_GP19: J7.B16
HPCC_B_GP20: J7.B17
HPCC_B_I2C_SCL: J7.A14
HPCC_B_I2C_SDA: J7.A15
HPCC_B_JTAG_TCK: J7.A3(A03)
HPCC_B_JTAG_TDI: J7.A7(A07)
HPCC_B_JTAG_TDO: J7.A6(A06)
HPCC_B_JTAG_TMS: J7.A2(A02)
HPCC_B_JTAG_TRST: J7.A10
HPCC_B_RES_1: J7.D1(D01) R71.2
HPCC_B_RES_2: J7.F1(F01) R74.2
HPCC_B_RES_3: J7.H1(H01) R77.2
HPCC_B_RES_4: J7.K1(K01) R72.2
HPCC_B_RES_5: J7.B40 R75.2
HPCC_B_RES_6: J7.D40 R78.2
HPCC_B_RES_7: J7.F40 R73.2
HPCC_B_RES_8: J7.H40 R76.2
HPCC_B_RES_9: J7.K40 R79.2
MST_PWR_GOOD: J7.B1(B01)

### Layout directives
differential pair; differential pair class DP100_HPCC_B: HPCC_B_01_N, HPCC_B_01_P, HPCC_B_02_N, HPCC_B_02_P, HPCC_B_03_N, HPCC_B_03_P, HPCC_B_04_N, HPCC_B_04_P, HPCC_B_05_N, HPCC_B_05_P, HPCC_B_06_N, HPCC_B_06_P, HPCC_B_07_N, HPCC_B_07_P, HPCC_B_08_N, HPCC_B_08_P, HPCC_B_09_N, HPCC_B_09_P, HPCC_B_10_N, HPCC_B_10_P, HPCC_B_11_N, HPCC_B_11_P, HPCC_B_12_N, HPCC_B_12_P, HPCC_B_13_N, HPCC_B_13_P, HPCC_B_14_N, HPCC_B_14_P, HPCC_B_15_N, HPCC_B_15_P, HPCC_B_16_N, HPCC_B_16_P, HPCC_B_17_N, HPCC_B_17_P, HPCC_B_18_N, HPCC_B_18_P, HPCC_B_19_N, HPCC_B_19_P, HPCC_B_20_N, HPCC_B_20_P, HPCC_B_21_N, HPCC_B_21_P, HPCC_B_22_N, HPCC_B_22_P, HPCC_B_23_N, HPCC_B_23_P, HPCC_B_24_N, HPCC_B_24_P, HPCC_B_25_N, HPCC_B_25_P, HPCC_B_26_N, HPCC_B_26_P, HPCC_B_27_N, HPCC_B_27_P, HPCC_B_28_N, HPCC_B_28_P, HPCC_B_29_N, HPCC_B_29_P, HPCC_B_30_N, HPCC_B_30_P, HPCC_B_31_N, HPCC_B_31_P, HPCC_B_32_N, HPCC_B_32_P, HPCC_B_33_N, HPCC_B_33_P, HPCC_B_34_N, HPCC_B_34_P, HPCC_B_35_N, HPCC_B_35_P, HPCC_B_36_N, HPCC_B_36_P, HPCC_B_37_N, HPCC_B_37_P, HPCC_B_38_N, HPCC_B_38_P, HPCC_B_39_N, HPCC_B_39_P, HPCC_B_40_N, HPCC_B_40_P, HPCC_B_41_N, HPCC_B_41_P, HPCC_B_42_N, HPCC_B_42_P, HPCC_B_43_N, HPCC_B_43_P, HPCC_B_44_N, HPCC_B_44_P, HPCC_B_45_N, HPCC_B_45_P, HPCC_B_46_N, HPCC_B_46_P, HPCC_B_47_N, HPCC_B_47_P, HPCC_B_48_N, HPCC_B_48_P, HPCC_B_49_N, HPCC_B_49_P, HPCC_B_50_N, HPCC_B_50_P, HPCC_B_51_N, HPCC_B_51_P, HPCC_B_52_N, HPCC_B_52_P, HPCC_B_53_N, HPCC_B_53_P, HPCC_B_54_N, HPCC_B_54_P, HPCC_B_55_N, HPCC_B_55_P, HPCC_B_56_N, HPCC_B_56_P, HPCC_B_57_N, HPCC_B_57_P, HPCC_B_58_N, HPCC_B_58_P, HPCC_B_59_N, HPCC_B_59_P, HPCC_B_60_N, HPCC_B_60_P, HPCC_B_61_N, HPCC_B_61_P, HPCC_B_62_N, HPCC_B_62_P, HPCC_B_63_N, HPCC_B_63_P, HPCC_B_64_N, HPCC_B_64_P, HPCC_B_65_N, HPCC_B_65_P, HPCC_B_66_N, HPCC_B_66_P, HPCC_B_67_N, HPCC_B_67_P, HPCC_B_68_N, HPCC_B_68_P, HPCC_B_69_N, HPCC_B_69_P, HPCC_B_70_N, HPCC_B_70_P, HPCC_B_71_N, HPCC_B_71_P, HPCC_B_72_N, HPCC_B_72_P
net class SE50_HPCC_B: HPCC_B_GP01, HPCC_B_GP02, HPCC_B_GP03, HPCC_B_GP04, HPCC_B_GP05, HPCC_B_GP06, HPCC_B_GP07, HPCC_B_GP08, HPCC_B_GP09, HPCC_B_GP10, HPCC_B_GP11, HPCC_B_GP12, HPCC_B_GP13, HPCC_B_GP14, HPCC_B_GP15, HPCC_B_GP16, HPCC_B_GP17, HPCC_B_GP18, HPCC_B_GP19, HPCC_B_GP20

### Notes on the sheet
- HPCC B Connector
- (in symbol Capstone_Title_Block) Title; Drawn By; Reviewed By; Date; Version; Sheet; of; Size

### Library data of the parts
J7 = ASP-134486-01: as J6 on sheet HPCC_Connector_A; Manufacturer Part Number: ASP-134486-01
R71-R79 = ERJ-2GE0R00X: as R62 on sheet HPCC_Connector_A; Manufacturer Part Number: ERJ-2GE0R00X
TITLEBLOCK?#6 = Capstone_Title_Block: as TITLEBLOCK?#1 on sheet Overview_Sheet; Manufacturer Part Number: NONE

## Sheet PMIC_3V3.SchDoc: 3.3V Power Supply
size B; CheckedBy: Jason Sullins; Author: Jordan Harris-Toovy; Revision: 0.2; SheetNumber: 13; SheetTotal: 22; Size: ANSI B
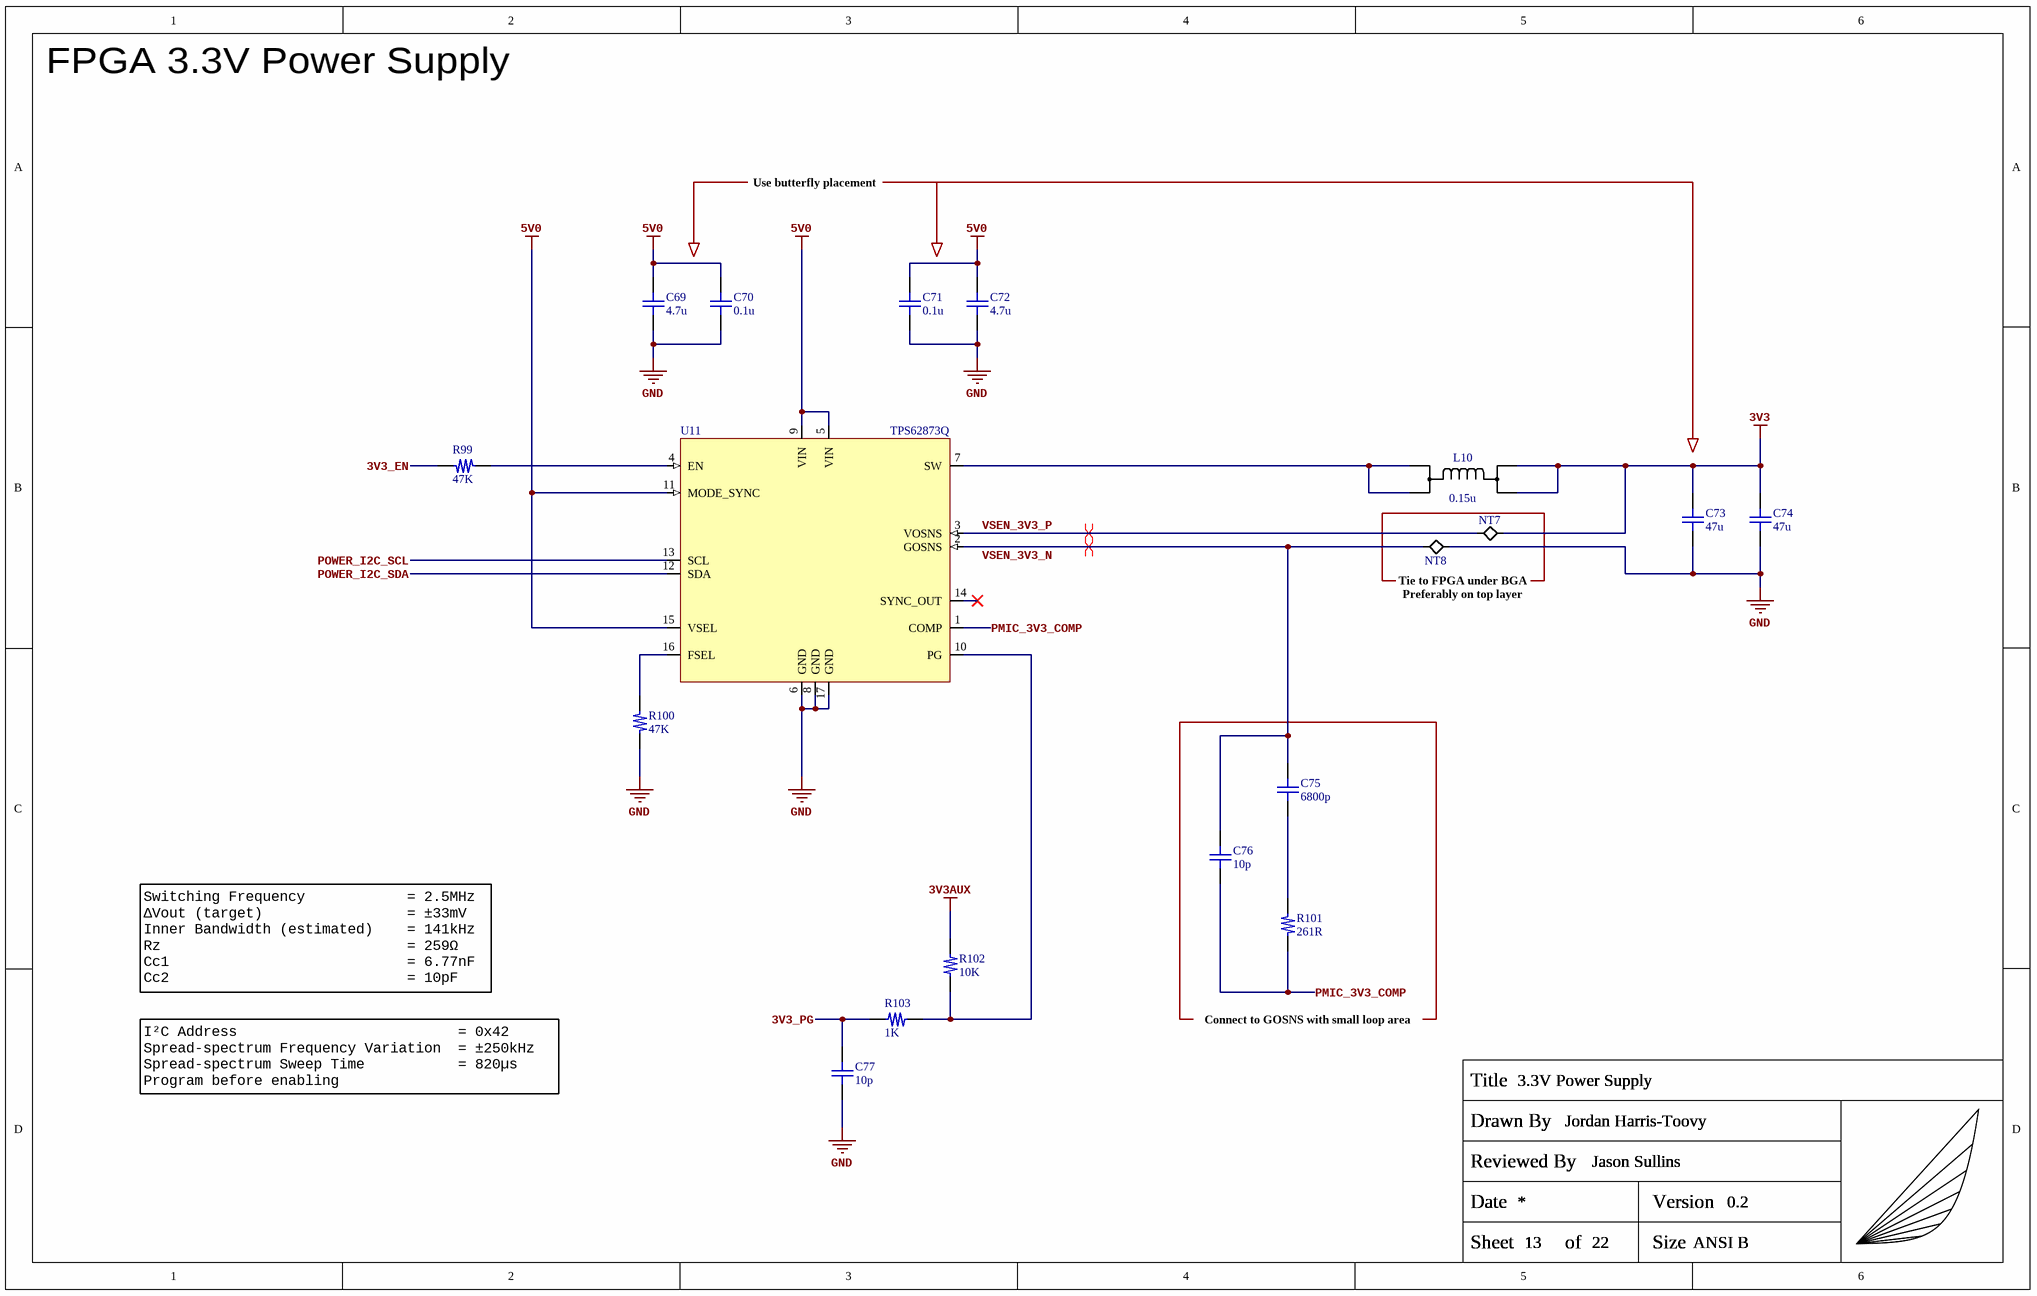
[diagram p6: PMIC_3V3.SchDoc]

### Parts
(Parts that share a designator on the sheet are numbered #1, #2 ... from top to bottom, then left to right.)
C69  4.7u  [C_0402_Generic]
C70  0.1u  [C_0402_Generic]
C71  0.1u  [C_0402_Generic]
C72  4.7u  [C_0402_Generic]
C73  47u  [C_0603_Generic]
C74  47u  [C_0603_Generic]
C75  6800p  [C_0402_Generic]
C76  10p  [C_0402_Generic]
C77  10p  [C_0402_Generic]
L10  0.15u  [TDK_CLT32]
NT7  NT  [SMD_NET_TIE]  (value not drawn)  (net tie, no BOM)
NT8  NT  [SMD_NET_TIE]  (value not drawn)  (net tie, no BOM)
R99  47K  [R_0402_Generic]
R100  47K  [R_0402_Generic]
R101  261R  [R_0402_Generic]
R102  10K  [R_0402_Generic]
R103  1K  [R_0402_Generic]
TITLEBLOCK?#7  Capstone_Title_Block  (value not drawn)  (graphical)
U11  TPS62873Q  [TPS6287x-Q1]

### Nets
3V3: C73.2 C74.2 L10.3(P3) L10.4(P4) NT7.2(P2)
3V3AUX: R102.2
5V0: C69.2 C70.2 C71.2 C72.2 U11.5(VIN) U11.9(VIN) U11.11(MODE_SYNC) U11.15(VSEL)
GND: C69.1 C70.1 C71.1 C72.1 C73.1 C74.1 C77.1 NT8.2(P2) R100.1 U11.6(GND) U11.8(GND) U11.17(GND)
3V3_EN: R99.2
3V3_PG: C77.2 R103.1
PMIC_3V3_COMP: C76.1 R101.1 U11.1(COMP)
POWER_I2C_SCL: U11.13(SCL)
POWER_I2C_SDA: U11.12(SDA)
VSEN_3V3_N: C75.2 C76.2 NT8.1(P1) U11.2(GOSNS)
VSEN_3V3_P: NT7.1(P1) U11.3(VOSNS)
NetC75_1: C75.1 R101.2
NetL10_1: L10.1(P1) L10.2(P2) U11.7(SW)
NetR99_1: R99.1 U11.4(EN)
NetR100_2: R100.2 U11.16(FSEL)
NetR102_1: R102.1 R103.2 U11.10(PG)

Not connected (* = marked no-connect by the designer): U11 14(SYNC_OUT)*

### Layout directives
differential pair; differential pair class DP_PMIC_SENSE: VSEN_3V3_N, VSEN_3V3_P

### Notes on the sheet
- FPGA 3.3V Power Supply
- Use butterfly placement
- Tie to FPGA under BGA
- Preferably on top layer
- Switching Frequency            = 2.5MHz
  ΔVout (target)                 = ±33mV
  Inner Bandwidth (estimated)    = 141kHz
  Rz                             = 259Ω
  Cc1                            = 6.77nF
  Cc2                            = 10pF
- Connect to GOSNS with small loop area
- I²C Address                          = 0x42
  Spread-spectrum Frequency Variation  = ±250kHz
  Spread-spectrum Sweep Time           = 820µs
  Program before enabling
- (in symbol Capstone_Title_Block) Title; Drawn By; Reviewed By; Date; Version; Sheet; of; Size

### Library data of the parts
C69 C72 = GRM155R61A475MEAAJ: 4.7µF 10V X5R SMD ceramic capacitor in 0402 size; Manufacturer: Murata Electronics; Manufacturer Part Number: GRM155R61A475MEAAJ
C70 C71 = GRM155R71C104KA88D: as C122 on sheet Flash_FPGA; Manufacturer Part Number: GRM155R71C104KA88D
C73 C74 = GRM188R60J476ME15D: 47µF 6.3V X5R SMD ceramic capacitor in 0603 size; Manufacturer: Murata Electronics; Manufacturer Part Number: GRM188R60J476ME15D
C75 = GRM155R71E682KA01D: 6800pF 25V X7R SMD ceramic capacitor in 0402 size; Manufacturer: Murata Electronics; Manufacturer Part Number: GRM155R71E682KA01D
C76 C77 = GRM1555C1H100JA01D: 10pF 50V C0G/NP0 SMD ceramic capacitor in 0402 size; Manufacturer: Murata Electronics; Manufacturer Part Number: GRM1555C1H100JA01D
L10 = CLT3217N: Inductor 150nH 3.3mOhm 25.4A AEC-Q200, TDK; Manufacturer: EPCOS/TDK; Manufacturer Part Number: CLT32-17N
NT7 NT8 = Net_Tie_SMD: SMD Net Tie; Manufacturer: NONE; Manufacturer Part Number: NONE
R99 R100 = ERJ-2RKF4702X: 47KOhm 1% 1/10W SMD resistor in 0402 size; Manufacturer: Panasonic; Manufacturer Part Number: ERJ-2RKF4702X
R101 = ERJ-2RKF2610X: 261Ohm 1% 1/10W SMD resistor in 0402 size; Manufacturer: Panasonic; Manufacturer Part Number: ERJ-2RKF2610X
R102 = ERJ-2RKF1002X: 10KOhm 1% 1/10W SMD resistor in 0402 size; Manufacturer: Panasonic; Manufacturer Part Number: ERJ-2RKF1002X
R103 = ERJ-2RKF1001X: 1KOhm 1% 1/10W SMD resistor in 0402 size; Manufacturer: Panasonic; Manufacturer Part Number: ERJ-2RKF1001X
TITLEBLOCK?#7 = Capstone_Title_Block: as TITLEBLOCK?#1 on sheet Overview_Sheet; Manufacturer Part Number: NONE
U11 = TPS62873QWRXSRQ1: Switching Voltage Regulators Automotive 2.7-V to 6-V input, 15-A, stackable, synchronous buck converter 16-VQFN-FCRLF -40 to 125C; Manufacturer: Texas Instruments; Manufacturer Part Number: TPS62873QWRXSRQ1

## Sheet PMIC_2V5.SchDoc: 2.5V Power Supply
size B; CheckedBy: Jason Sullins; Author: Jordan Harris-Toovy; Revision: 0.2; SheetNumber: 12; SheetTotal: 22; Size: ANSI B
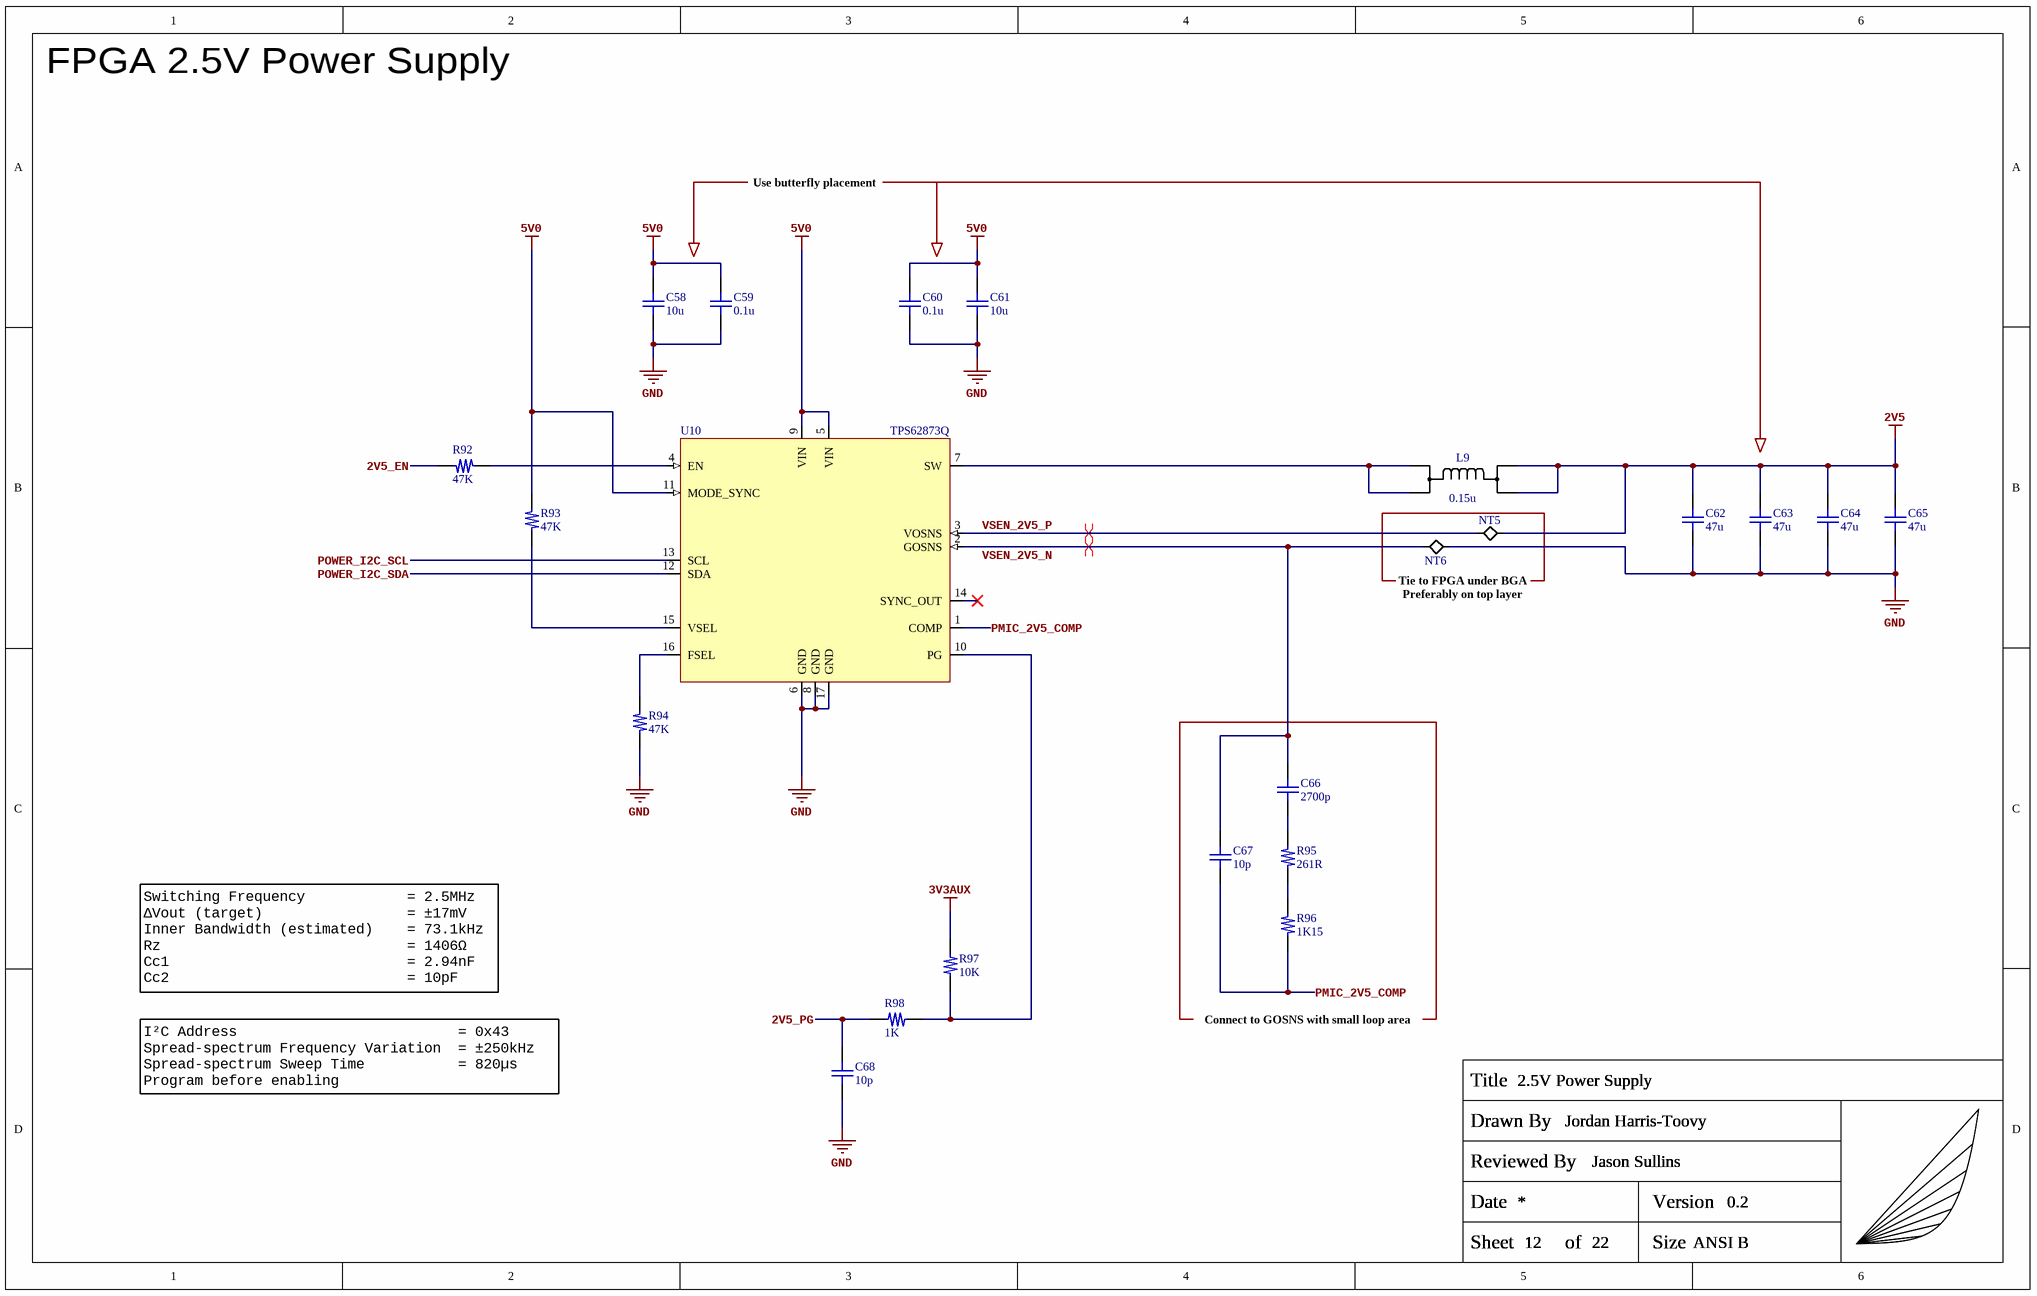
[diagram p7: PMIC_2V5.SchDoc]

### Parts
(Parts that share a designator on the sheet are numbered #1, #2 ... from top to bottom, then left to right.)
C58  10u  [C_0402_Generic]
C59  0.1u  [C_0402_Generic]
C60  0.1u  [C_0402_Generic]
C61  10u  [C_0402_Generic]
C62  47u  [C_0603_Generic]
C63  47u  [C_0603_Generic]
C64  47u  [C_0603_Generic]
C65  47u  [C_0603_Generic]
C66  2700p  [C_0402_Generic]
C67  10p  [C_0402_Generic]
C68  10p  [C_0402_Generic]
L9  0.15u  [TDK_CLT32]
NT5  NT  [SMD_NET_TIE]  (value not drawn)  (net tie, no BOM)
NT6  NT  [SMD_NET_TIE]  (value not drawn)  (net tie, no BOM)
R92  47K  [R_0402_Generic]
R93  47K  [R_0402_Generic]
R94  47K  [R_0402_Generic]
R95  261R  [R_0402_Generic]
R96  1K15  [R_0402_Generic]
R97  10K  [R_0402_Generic]
R98  1K  [R_0402_Generic]
TITLEBLOCK?#8  Capstone_Title_Block  (value not drawn)  (graphical)
U10  TPS62873Q  [TPS6287x-Q1]

### Nets
2V5: C62.2 C63.2 C64.2 C65.2 L9.3(P3) L9.4(P4) NT5.2(P2)
3V3AUX: R97.2
5V0: C58.2 C59.2 C60.2 C61.2 R93.2 U10.5(VIN) U10.9(VIN) U10.11(MODE_SYNC)
GND: C58.1 C59.1 C60.1 C61.1 C62.1 C63.1 C64.1 C65.1 C68.1 NT6.2(P2) R94.1 U10.6(GND) U10.8(GND) U10.17(GND)
2V5_EN: R92.2
2V5_PG: C68.2 R98.1
PMIC_2V5_COMP: C67.1 R96.1 U10.1(COMP)
POWER_I2C_SCL: U10.13(SCL)
POWER_I2C_SDA: U10.12(SDA)
VSEN_2V5_N: C66.2 C67.2 NT6.1(P1) U10.2(GOSNS)
VSEN_2V5_P: NT5.1(P1) U10.3(VOSNS)
NetC66_1: C66.1 R95.2
NetL9_1: L9.1(P1) L9.2(P2) U10.7(SW)
NetR92_1: R92.1 U10.4(EN)
NetR93_1: R93.1 U10.15(VSEL)
NetR94_2: R94.2 U10.16(FSEL)
NetR95_1: R95.1 R96.2
NetR97_1: R97.1 R98.2 U10.10(PG)

Not connected (* = marked no-connect by the designer): U10 14(SYNC_OUT)*

### Layout directives
differential pair; differential pair class DP_PMIC_SENSE: VSEN_2V5_N, VSEN_2V5_P

### Notes on the sheet
- FPGA 2.5V Power Supply
- Use butterfly placement
- Tie to FPGA under BGA
- Preferably on top layer
- Switching Frequency            = 2.5MHz
  ΔVout (target)                 = ±17mV
  Inner Bandwidth (estimated)    = 73.1kHz
  Rz                             = 1406Ω
  Cc1                            = 2.94nF
  Cc2                            = 10pF
- Connect to GOSNS with small loop area
- I²C Address                          = 0x43
  Spread-spectrum Frequency Variation  = ±250kHz
  Spread-spectrum Sweep Time           = 820µs
  Program before enabling
- (in symbol Capstone_Title_Block) Title; Drawn By; Reviewed By; Date; Version; Sheet; of; Size

### Library data of the parts
C58 C61 = CC0402MRX5R6BB106: 10µF 10V X5R SMD ceramic capacitor in 0402 size; Manufacturer: YAGEO; Manufacturer Part Number: CC0402MRX5R6BB106
C59 C60 = GRM155R71C104KA88D: as C122 on sheet Flash_FPGA; Manufacturer Part Number: GRM155R71C104KA88D
C62-C65 = GRM188R60J476ME15D: as C73 on sheet PMIC_3V3; Manufacturer Part Number: GRM188R60J476ME15D
C66 = GCM155R71H272KA37D: 2700pF 50V X7R SMD ceramic capacitor in 0402 size; Manufacturer: Murata Electronics; Manufacturer Part Number: GCM155R71H272KA37D
C67 C68 = GRM1555C1H100JA01D: as C76 on sheet PMIC_3V3; Manufacturer Part Number: GRM1555C1H100JA01D
L9 = CLT3217N: as L10 on sheet PMIC_3V3
NT5 NT6 = Net_Tie_SMD: SMD Net Tie; Manufacturer: NONE; Manufacturer Part Number: NONE
R92-R94 = ERJ-2RKF4702X: as R99 on sheet PMIC_3V3; Manufacturer Part Number: ERJ-2RKF4702X
R95 = ERJ-2RKF2610X: as R101 on sheet PMIC_3V3; Manufacturer Part Number: ERJ-2RKF2610X
R96 = ERJ-2RKF1151X: 1.15KOhm 1% 1/10W SMD resistor in 0402 size; Manufacturer: Panasonic; Manufacturer Part Number: ERJ-2RKF1151X
R97 = ERJ-2RKF1002X: as R102 on sheet PMIC_3V3; Manufacturer Part Number: ERJ-2RKF1002X
R98 = ERJ-2RKF1001X: as R103 on sheet PMIC_3V3; Manufacturer Part Number: ERJ-2RKF1001X
TITLEBLOCK?#8 = Capstone_Title_Block: as TITLEBLOCK?#1 on sheet Overview_Sheet; Manufacturer Part Number: NONE
U10 = TPS62873QWRXSRQ1: as U11 on sheet PMIC_3V3; Manufacturer Part Number: TPS62873QWRXSRQ1

## Sheet PMIC_1V8.SchDoc: 1.8V Power Supply
size B; CheckedBy: Jason Sullins; Author: Jordan Harris-Toovy; Revision: 0.2; SheetNumber: 11; SheetTotal: 22; Size: ANSI B
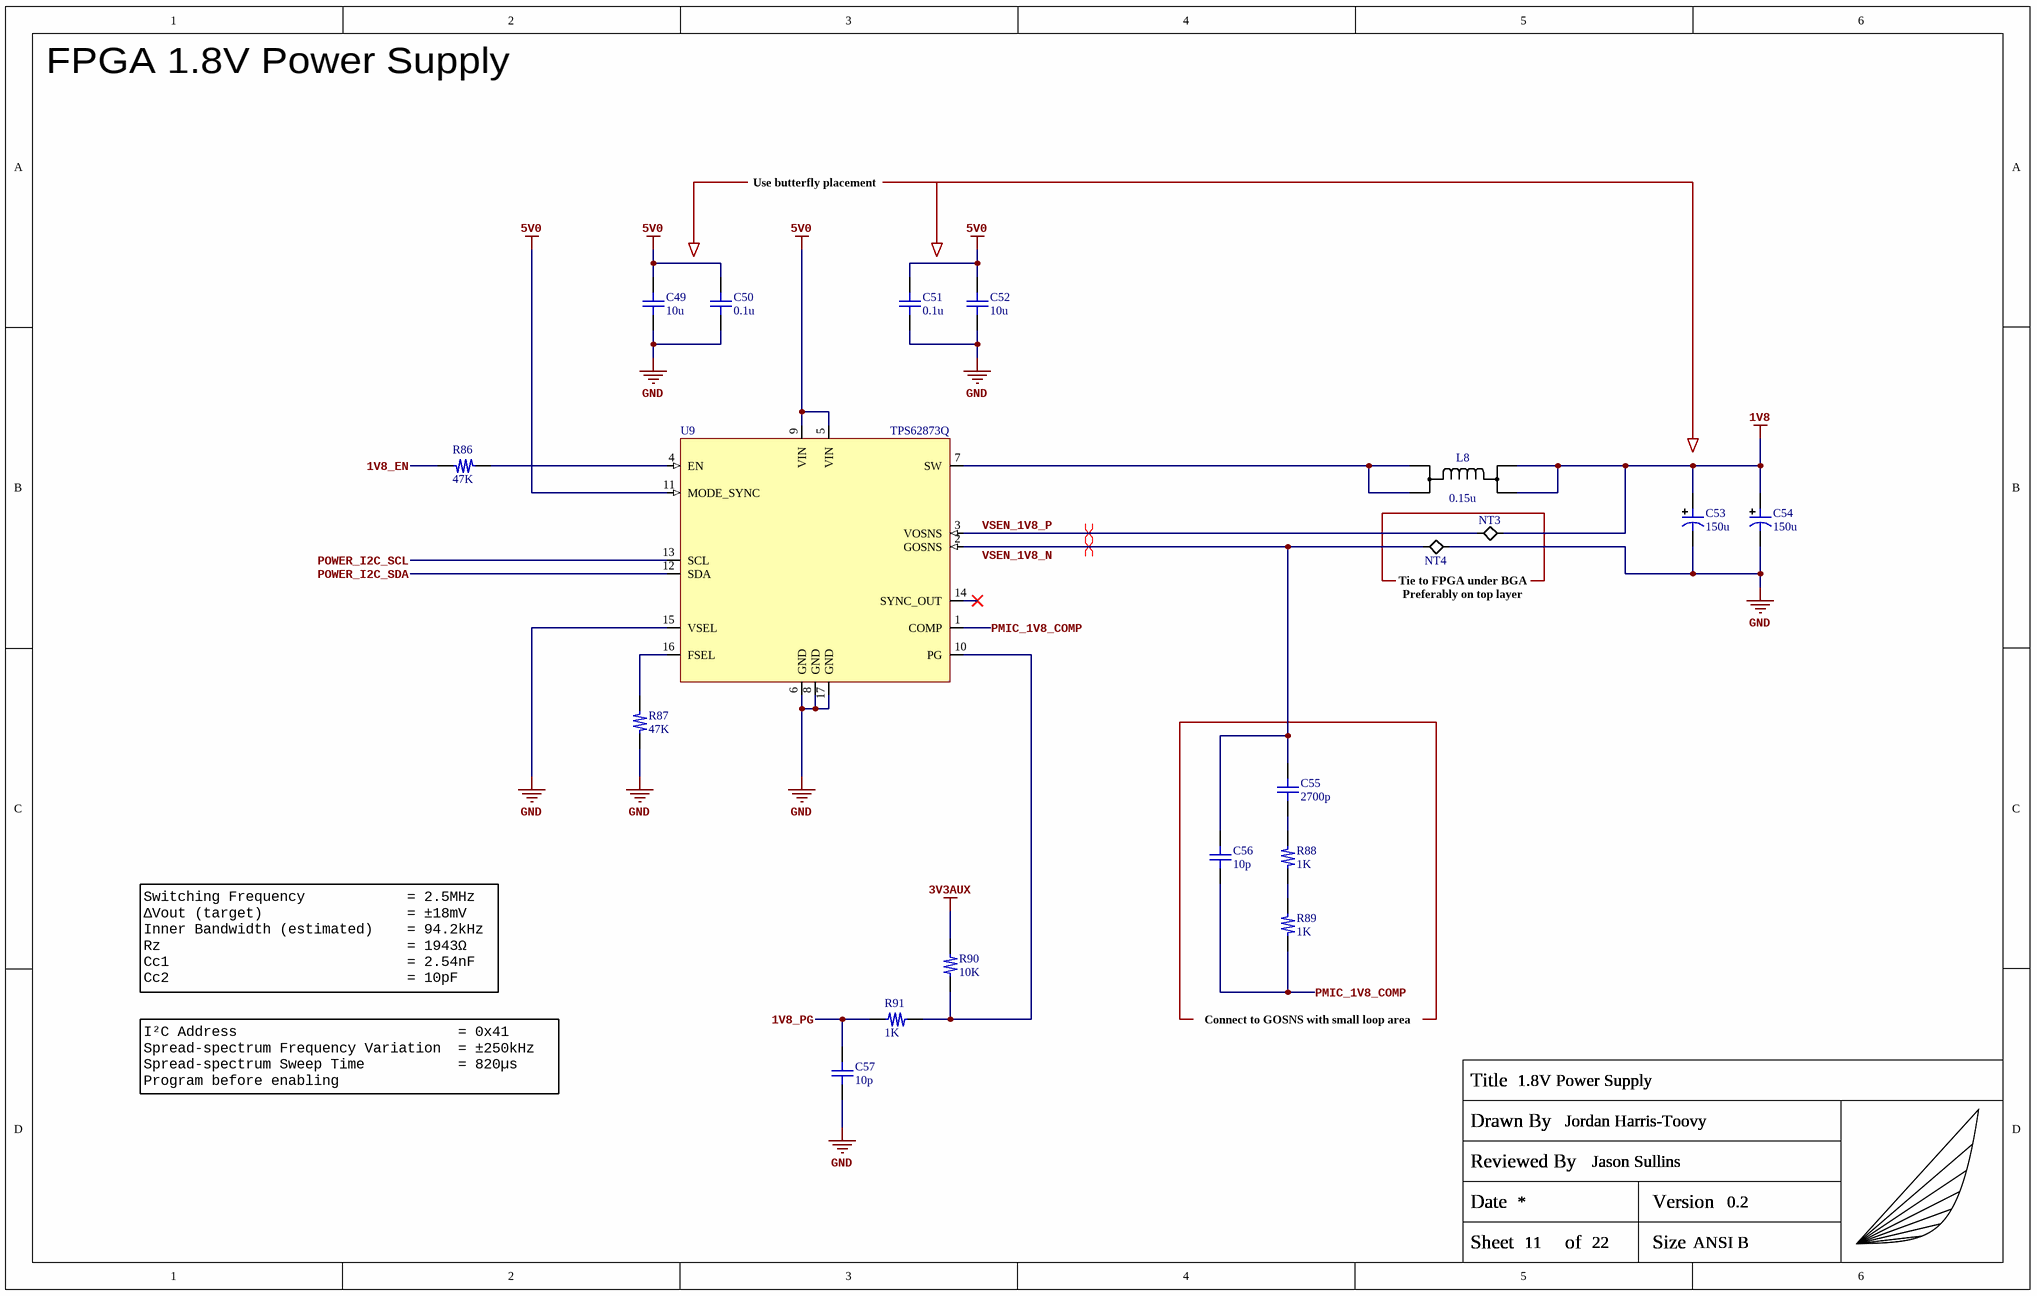
[diagram p8: PMIC_1V8.SchDoc]

### Parts
(Parts that share a designator on the sheet are numbered #1, #2 ... from top to bottom, then left to right.)
C49  10u  [C_0402_Generic]
C50  0.1u  [C_0402_Generic]
C51  0.1u  [C_0402_Generic]
C52  10u  [C_0402_Generic]
C53  150u  [C_TANT_EIA-3528-21_B]
C54  150u  [C_TANT_EIA-3528-21_B]
C55  2700p  [C_0402_Generic]
C56  10p  [C_0402_Generic]
C57  10p  [C_0402_Generic]
L8  0.15u  [TDK_CLT32]
NT3  NT  [SMD_NET_TIE]  (value not drawn)  (net tie, no BOM)
NT4  NT  [SMD_NET_TIE]  (value not drawn)  (net tie, no BOM)
R86  47K  [R_0402_Generic]
R87  47K  [R_0402_Generic]
R88  1K  [R_0402_Generic]
R89  1K  [R_0402_Generic]
R90  10K  [R_0402_Generic]
R91  1K  [R_0402_Generic]
TITLEBLOCK?#9  Capstone_Title_Block  (value not drawn)  (graphical)
U9  TPS62873Q  [TPS6287x-Q1]

### Nets
1V8: C53.1 C54.1 L8.3(P3) L8.4(P4) NT3.2(P2)
3V3AUX: R90.2
5V0: C49.2 C50.2 C51.2 C52.2 U9.5(VIN) U9.9(VIN) U9.11(MODE_SYNC)
GND: C49.1 C50.1 C51.1 C52.1 C53.2 C54.2 C57.1 NT4.2(P2) R87.1 U9.6(GND) U9.8(GND) U9.15(VSEL) U9.17(GND)
1V8_EN: R86.2
1V8_PG: C57.2 R91.1
PMIC_1V8_COMP: C56.1 R89.1 U9.1(COMP)
POWER_I2C_SCL: U9.13(SCL)
POWER_I2C_SDA: U9.12(SDA)
VSEN_1V8_N: C55.2 C56.2 NT4.1(P1) U9.2(GOSNS)
VSEN_1V8_P: NT3.1(P1) U9.3(VOSNS)
NetC55_1: C55.1 R88.2
NetL8_1: L8.1(P1) L8.2(P2) U9.7(SW)
NetR86_1: R86.1 U9.4(EN)
NetR87_2: R87.2 U9.16(FSEL)
NetR88_1: R88.1 R89.2
NetR90_1: R90.1 R91.2 U9.10(PG)

Not connected (* = marked no-connect by the designer): U9 14(SYNC_OUT)*

### Layout directives
differential pair; differential pair class DP_PMIC_SENSE: VSEN_1V8_N, VSEN_1V8_P

### Notes on the sheet
- FPGA 1.8V Power Supply
- Use butterfly placement
- Tie to FPGA under BGA
- Preferably on top layer
- Switching Frequency            = 2.5MHz
  ΔVout (target)                 = ±18mV
  Inner Bandwidth (estimated)    = 94.2kHz
  Rz                             = 1943Ω
  Cc1                            = 2.54nF
  Cc2                            = 10pF
- Connect to GOSNS with small loop area
- I²C Address                          = 0x41
  Spread-spectrum Frequency Variation  = ±250kHz
  Spread-spectrum Sweep Time           = 820µs
  Program before enabling
- (in symbol Capstone_Title_Block) Title; Drawn By; Reviewed By; Date; Version; Sheet; of; Size

### Library data of the parts
C49 C52 = CC0402MRX5R6BB106: as C58 on sheet PMIC_2V5; Manufacturer Part Number: CC0402MRX5R6BB106
C50 C51 = GRM155R71C104KA88D: as C122 on sheet Flash_FPGA; Manufacturer Part Number: GRM155R71C104KA88D
C53 C54 = T55B157M6R3C0025: 150µF 6.3V 25mOhm SMD tantalum capacitor in EIA-3528-21size; Manufacturer: Vishay Polytech; Manufacturer Part Number: T55B157M6R3C0025
C55 = GCM155R71H272KA37D: as C66 on sheet PMIC_2V5; Manufacturer Part Number: GCM155R71H272KA37D
C56 C57 = GRM1555C1H100JA01D: as C76 on sheet PMIC_3V3; Manufacturer Part Number: GRM1555C1H100JA01D
L8 = CLT3217N: as L10 on sheet PMIC_3V3
NT3 NT4 = Net_Tie_SMD: SMD Net Tie; Manufacturer: NONE; Manufacturer Part Number: NONE
R86 R87 = ERJ-2RKF4702X: as R99 on sheet PMIC_3V3; Manufacturer Part Number: ERJ-2RKF4702X
R88 R89 R91 = ERJ-2RKF1001X: as R103 on sheet PMIC_3V3; Manufacturer Part Number: ERJ-2RKF1001X
R90 = ERJ-2RKF1002X: as R102 on sheet PMIC_3V3; Manufacturer Part Number: ERJ-2RKF1002X
TITLEBLOCK?#9 = Capstone_Title_Block: as TITLEBLOCK?#1 on sheet Overview_Sheet; Manufacturer Part Number: NONE
U9 = TPS62873QWRXSRQ1: as U11 on sheet PMIC_3V3; Manufacturer Part Number: TPS62873QWRXSRQ1

## Sheet PMIC_1V0.SchDoc: 1.0V Power Supply
size B; CheckedBy: Jason Sullins; Author: Jordan Harris-Toovy; Revision: 0.2; SheetNumber: 10; SheetTotal: 22; Size: ANSI B
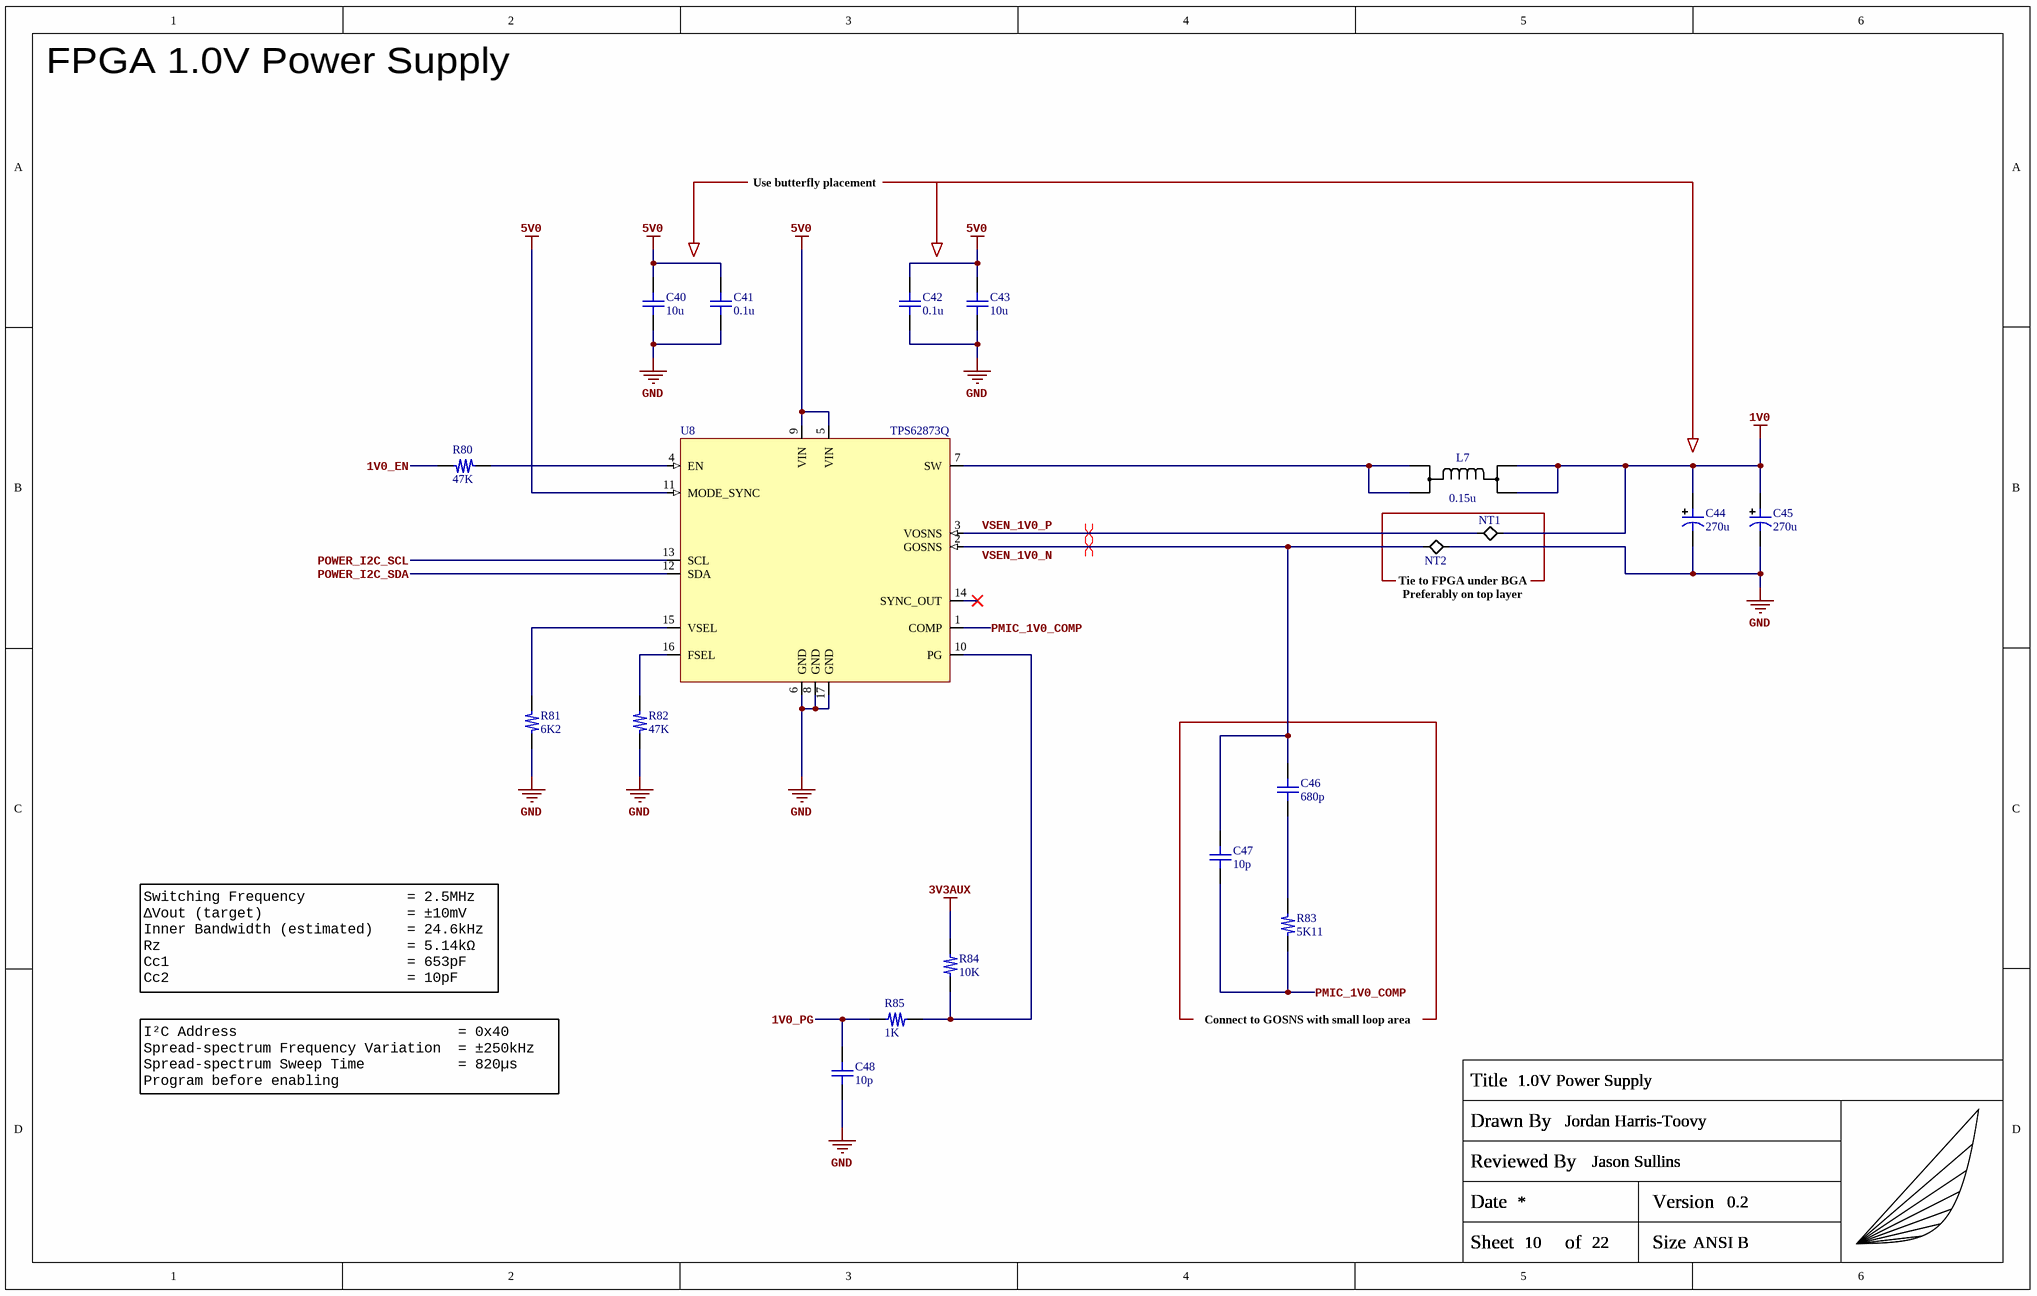
[diagram p9: PMIC_1V0.SchDoc]

### Parts
(Parts that share a designator on the sheet are numbered #1, #2 ... from top to bottom, then left to right.)
C40  10u  [C_0402_Generic]
C41  0.1u  [C_0402_Generic]
C42  0.1u  [C_0402_Generic]
C43  10u  [C_0402_Generic]
C44  270u  [C_TANT_EIA-3528-21_A]
C45  270u  [C_TANT_EIA-3528-21_A]
C46  680p  [C_0402_Generic]
C47  10p  [C_0402_Generic]
C48  10p  [C_0402_Generic]
L7  0.15u  [TDK_CLT32]
NT1  NT  [SMD_NET_TIE]  (value not drawn)  (net tie, no BOM)
NT2  NT  [SMD_NET_TIE]  (value not drawn)  (net tie, no BOM)
R80  47K  [R_0402_Generic]
R81  6K2  [R_0402_Generic]
R82  47K  [R_0402_Generic]
R83  5K11  [R_0402_Generic]
R84  10K  [R_0402_Generic]
R85  1K  [R_0402_Generic]
TITLEBLOCK?#10  Capstone_Title_Block  (value not drawn)  (graphical)
U8  TPS62873Q  [TPS6287x-Q1]

### Nets
1V0: C44.1 C45.1 L7.3(P3) L7.4(P4) NT1.2(P2)
3V3AUX: R84.2
5V0: C40.2 C41.2 C42.2 C43.2 U8.5(VIN) U8.9(VIN) U8.11(MODE_SYNC)
GND: C40.1 C41.1 C42.1 C43.1 C44.2 C45.2 C48.1 NT2.2(P2) R81.1 R82.1 U8.6(GND) U8.8(GND) U8.17(GND)
1V0_EN: R80.2
1V0_PG: C48.2 R85.1
PMIC_1V0_COMP: C47.1 R83.1 U8.1(COMP)
POWER_I2C_SCL: U8.13(SCL)
POWER_I2C_SDA: U8.12(SDA)
VSEN_1V0_N: C46.2 C47.2 NT2.1(P1) U8.2(GOSNS)
VSEN_1V0_P: NT1.1(P1) U8.3(VOSNS)
NetC46_1: C46.1 R83.2
NetL7_1: L7.1(P1) L7.2(P2) U8.7(SW)
NetR80_1: R80.1 U8.4(EN)
NetR81_2: R81.2 U8.15(VSEL)
NetR82_2: R82.2 U8.16(FSEL)
NetR84_1: R84.1 R85.2 U8.10(PG)

Not connected (* = marked no-connect by the designer): U8 14(SYNC_OUT)*

### Layout directives
differential pair; differential pair class DP_PMIC_SENSE: VSEN_1V0_N, VSEN_1V0_P

### Notes on the sheet
- FPGA 1.0V Power Supply
- Use butterfly placement
- Tie to FPGA under BGA
- Preferably on top layer
- Switching Frequency            = 2.5MHz
  ΔVout (target)                 = ±10mV
  Inner Bandwidth (estimated)    = 24.6kHz
  Rz                             = 5.14kΩ
  Cc1                            = 653pF
  Cc2                            = 10pF
- Connect to GOSNS with small loop area
- I²C Address                          = 0x40
  Spread-spectrum Frequency Variation  = ±250kHz
  Spread-spectrum Sweep Time           = 820µs
  Program before enabling
- (in symbol Capstone_Title_Block) Title; Drawn By; Reviewed By; Date; Version; Sheet; of; Size

### Library data of the parts
C40 C43 = CC0402MRX5R6BB106: as C58 on sheet PMIC_2V5; Manufacturer Part Number: CC0402MRX5R6BB106
C41 C42 = GRM155R71C104KA88D: as C122 on sheet Flash_FPGA; Manufacturer Part Number: GRM155R71C104KA88D
C44 C45 = 2TPSF270M9G: 270µF 2V 9mOhm SMD tantalum capacitor in EIA-3528-21size; Manufacturer: Panasonic; Manufacturer Part Number: 2TPSF270M9G
C46 = GCM1555C1H681FA16D: 680pF 50V C0G/NP0 SMD ceramic capacitor in 0402 size; Manufacturer: Murata Electronics; Manufacturer Part Number: GCM1555C1H681FA16D
C47 C48 = GRM1555C1H100JA01D: as C76 on sheet PMIC_3V3; Manufacturer Part Number: GRM1555C1H100JA01D
L7 = CLT3217N: as L10 on sheet PMIC_3V3
NT1 NT2 = Net_Tie_SMD: SMD Net Tie; Manufacturer: NONE; Manufacturer Part Number: NONE
R80 R82 = ERJ-2RKF4702X: as R99 on sheet PMIC_3V3; Manufacturer Part Number: ERJ-2RKF4702X
R81 = ERJ-2RKF6201X: 6.2KOhm 1% 1/10W SMD resistor in 0402 size; Manufacturer: Panasonic; Manufacturer Part Number: ERJ-2RKF6201X
R83 = ERJ-2RKF5111X: 5.11KOhm 1% 1/10W SMD resistor in 0402 size; Manufacturer: Panasonic; Manufacturer Part Number: ERJ-2RKF5111X
R84 = ERJ-2RKF1002X: as R102 on sheet PMIC_3V3; Manufacturer Part Number: ERJ-2RKF1002X
R85 = ERJ-2RKF1001X: as R103 on sheet PMIC_3V3; Manufacturer Part Number: ERJ-2RKF1001X
TITLEBLOCK?#10 = Capstone_Title_Block: as TITLEBLOCK?#1 on sheet Overview_Sheet; Manufacturer Part Number: NONE
U8 = TPS62873QWRXSRQ1: as U11 on sheet PMIC_3V3; Manufacturer Part Number: TPS62873QWRXSRQ1

## Sheet I2C_Temperature_Sensors.SchDoc: PMIC-Area Temperature Sensors
size B; CheckedBy: Jason Sullins; Author: Jordan Harris-Toovy; Revision: 0.2; SheetNumber: 6; SheetTotal: 22; Size: ANSI B
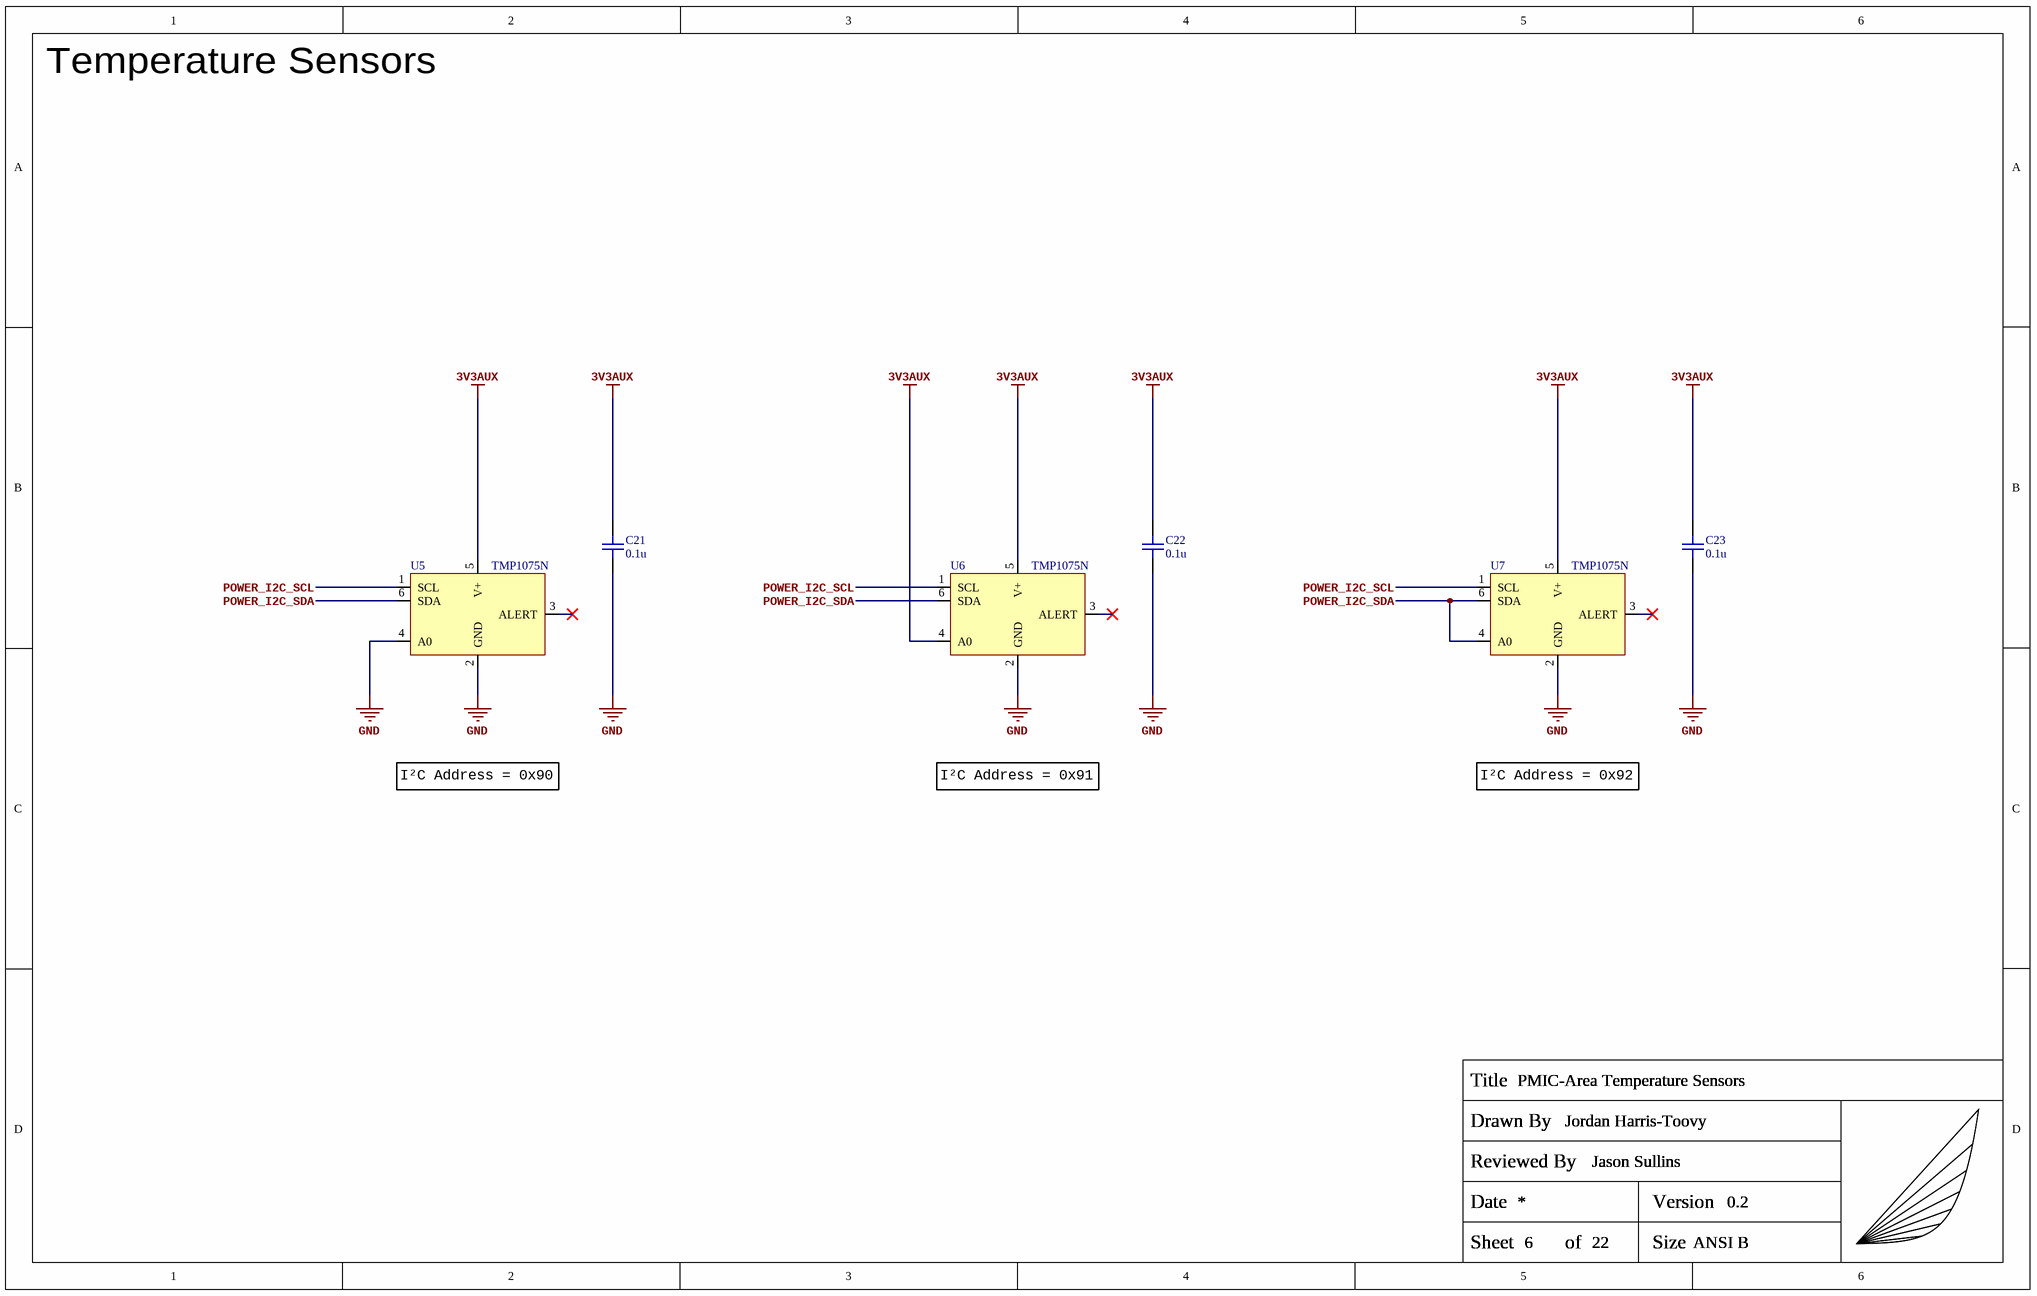
[diagram p10: I2C_Temperature_Sensors.SchDoc]

### Parts
(Parts that share a designator on the sheet are numbered #1, #2 ... from top to bottom, then left to right.)
C21  0.1u  [C_0402_Generic]
C22  0.1u  [C_0402_Generic]
C23  0.1u  [C_0402_Generic]
TITLEBLOCK?#11  Capstone_Title_Block  (value not drawn)  (graphical)
U5  TMP1075N  [TI_SOT-563]
U6  TMP1075N  [TI_SOT-563]
U7  TMP1075N  [TI_SOT-563]

### Nets
3V3AUX: C21.2 C22.2 C23.2 U5.5(V+) U6.4(A0) U6.5(V+) U7.5(V+)
GND: C21.1 C22.1 C23.1 U5.2(GND) U5.4(A0) U6.2(GND) U7.2(GND)
POWER_I2C_SCL: U5.1(SCL) U6.1(SCL) U7.1(SCL)
POWER_I2C_SDA: U5.6(SDA) U6.6(SDA) U7.4(A0) U7.6(SDA)

Not connected (* = marked no-connect by the designer): U5 3(ALERT)*; U6 3(ALERT)*; U7 3(ALERT)*

### Notes on the sheet
- Temperature Sensors
- I²C Address = 0x90
- I²C Address = 0x91
- I²C Address = 0x92
- (in symbol Capstone_Title_Block) Title; Drawn By; Reviewed By; Date; Version; Sheet; of; Size

### Library data of the parts
C21-C23 = GRM155R71C104KA88D: as C122 on sheet Flash_FPGA; Manufacturer Part Number: GRM155R71C104KA88D
TITLEBLOCK?#11 = Capstone_Title_Block: as TITLEBLOCK?#1 on sheet Overview_Sheet; Manufacturer Part Number: NONE
U5-U7 = TMP1075NDRLR: Temperature Sensor Digital, Local -40°C ~ 125°C 12 b SOT-563; Manufacturer: Texas Instruments; Manufacturer Part Number: TMP1075NDRLR